# EasyEDA Pro project RCkid.epro, schematic RCKid

## Sheets
1 Power: Board Name: RCKid; Create Date: 2023-09-18; Page Name: Power; Project Name: RCKid3; Schematic Name: RCKid; Update Date: 2025-01-19; Company: EasyEDA.com; Drawed: EasyEDAPro; Page Size: A4; Part Number: JLCPCB-002; Reviewed: EasyEDAPro; Version: V0.1
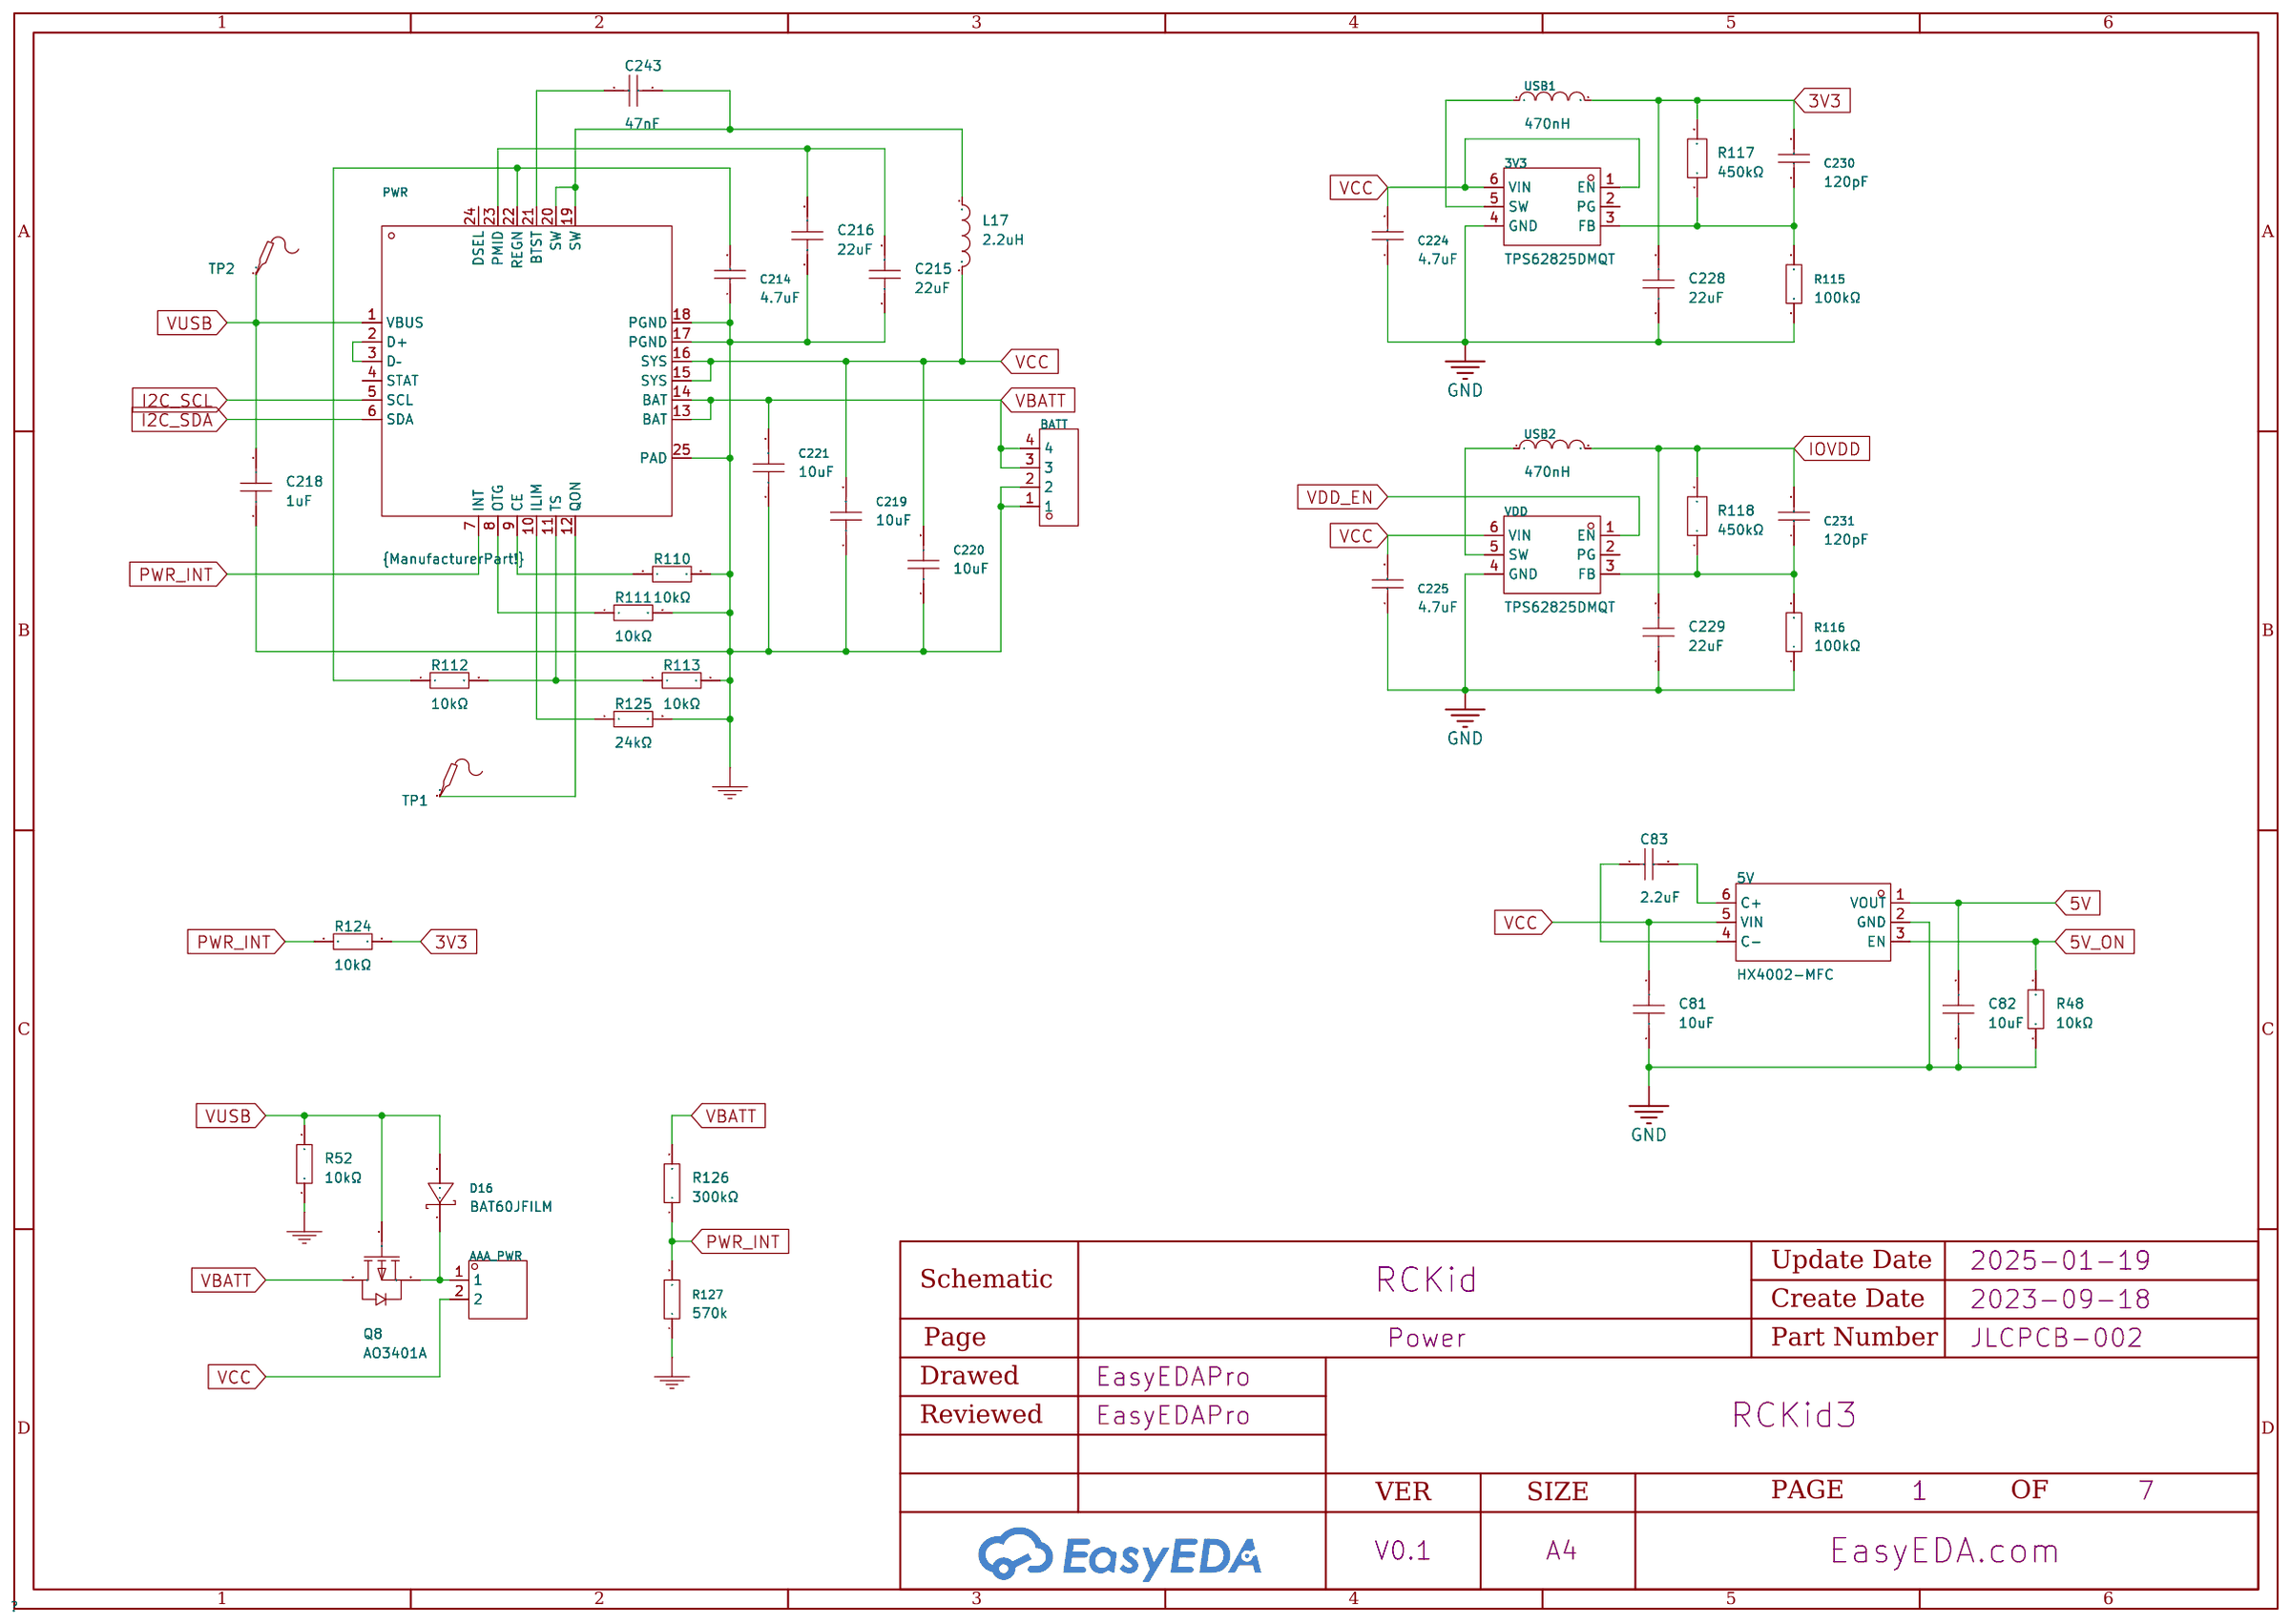
[diagram p7: Power]
2 Logic: Page Name: Logic; Update Date: 2025-01-14
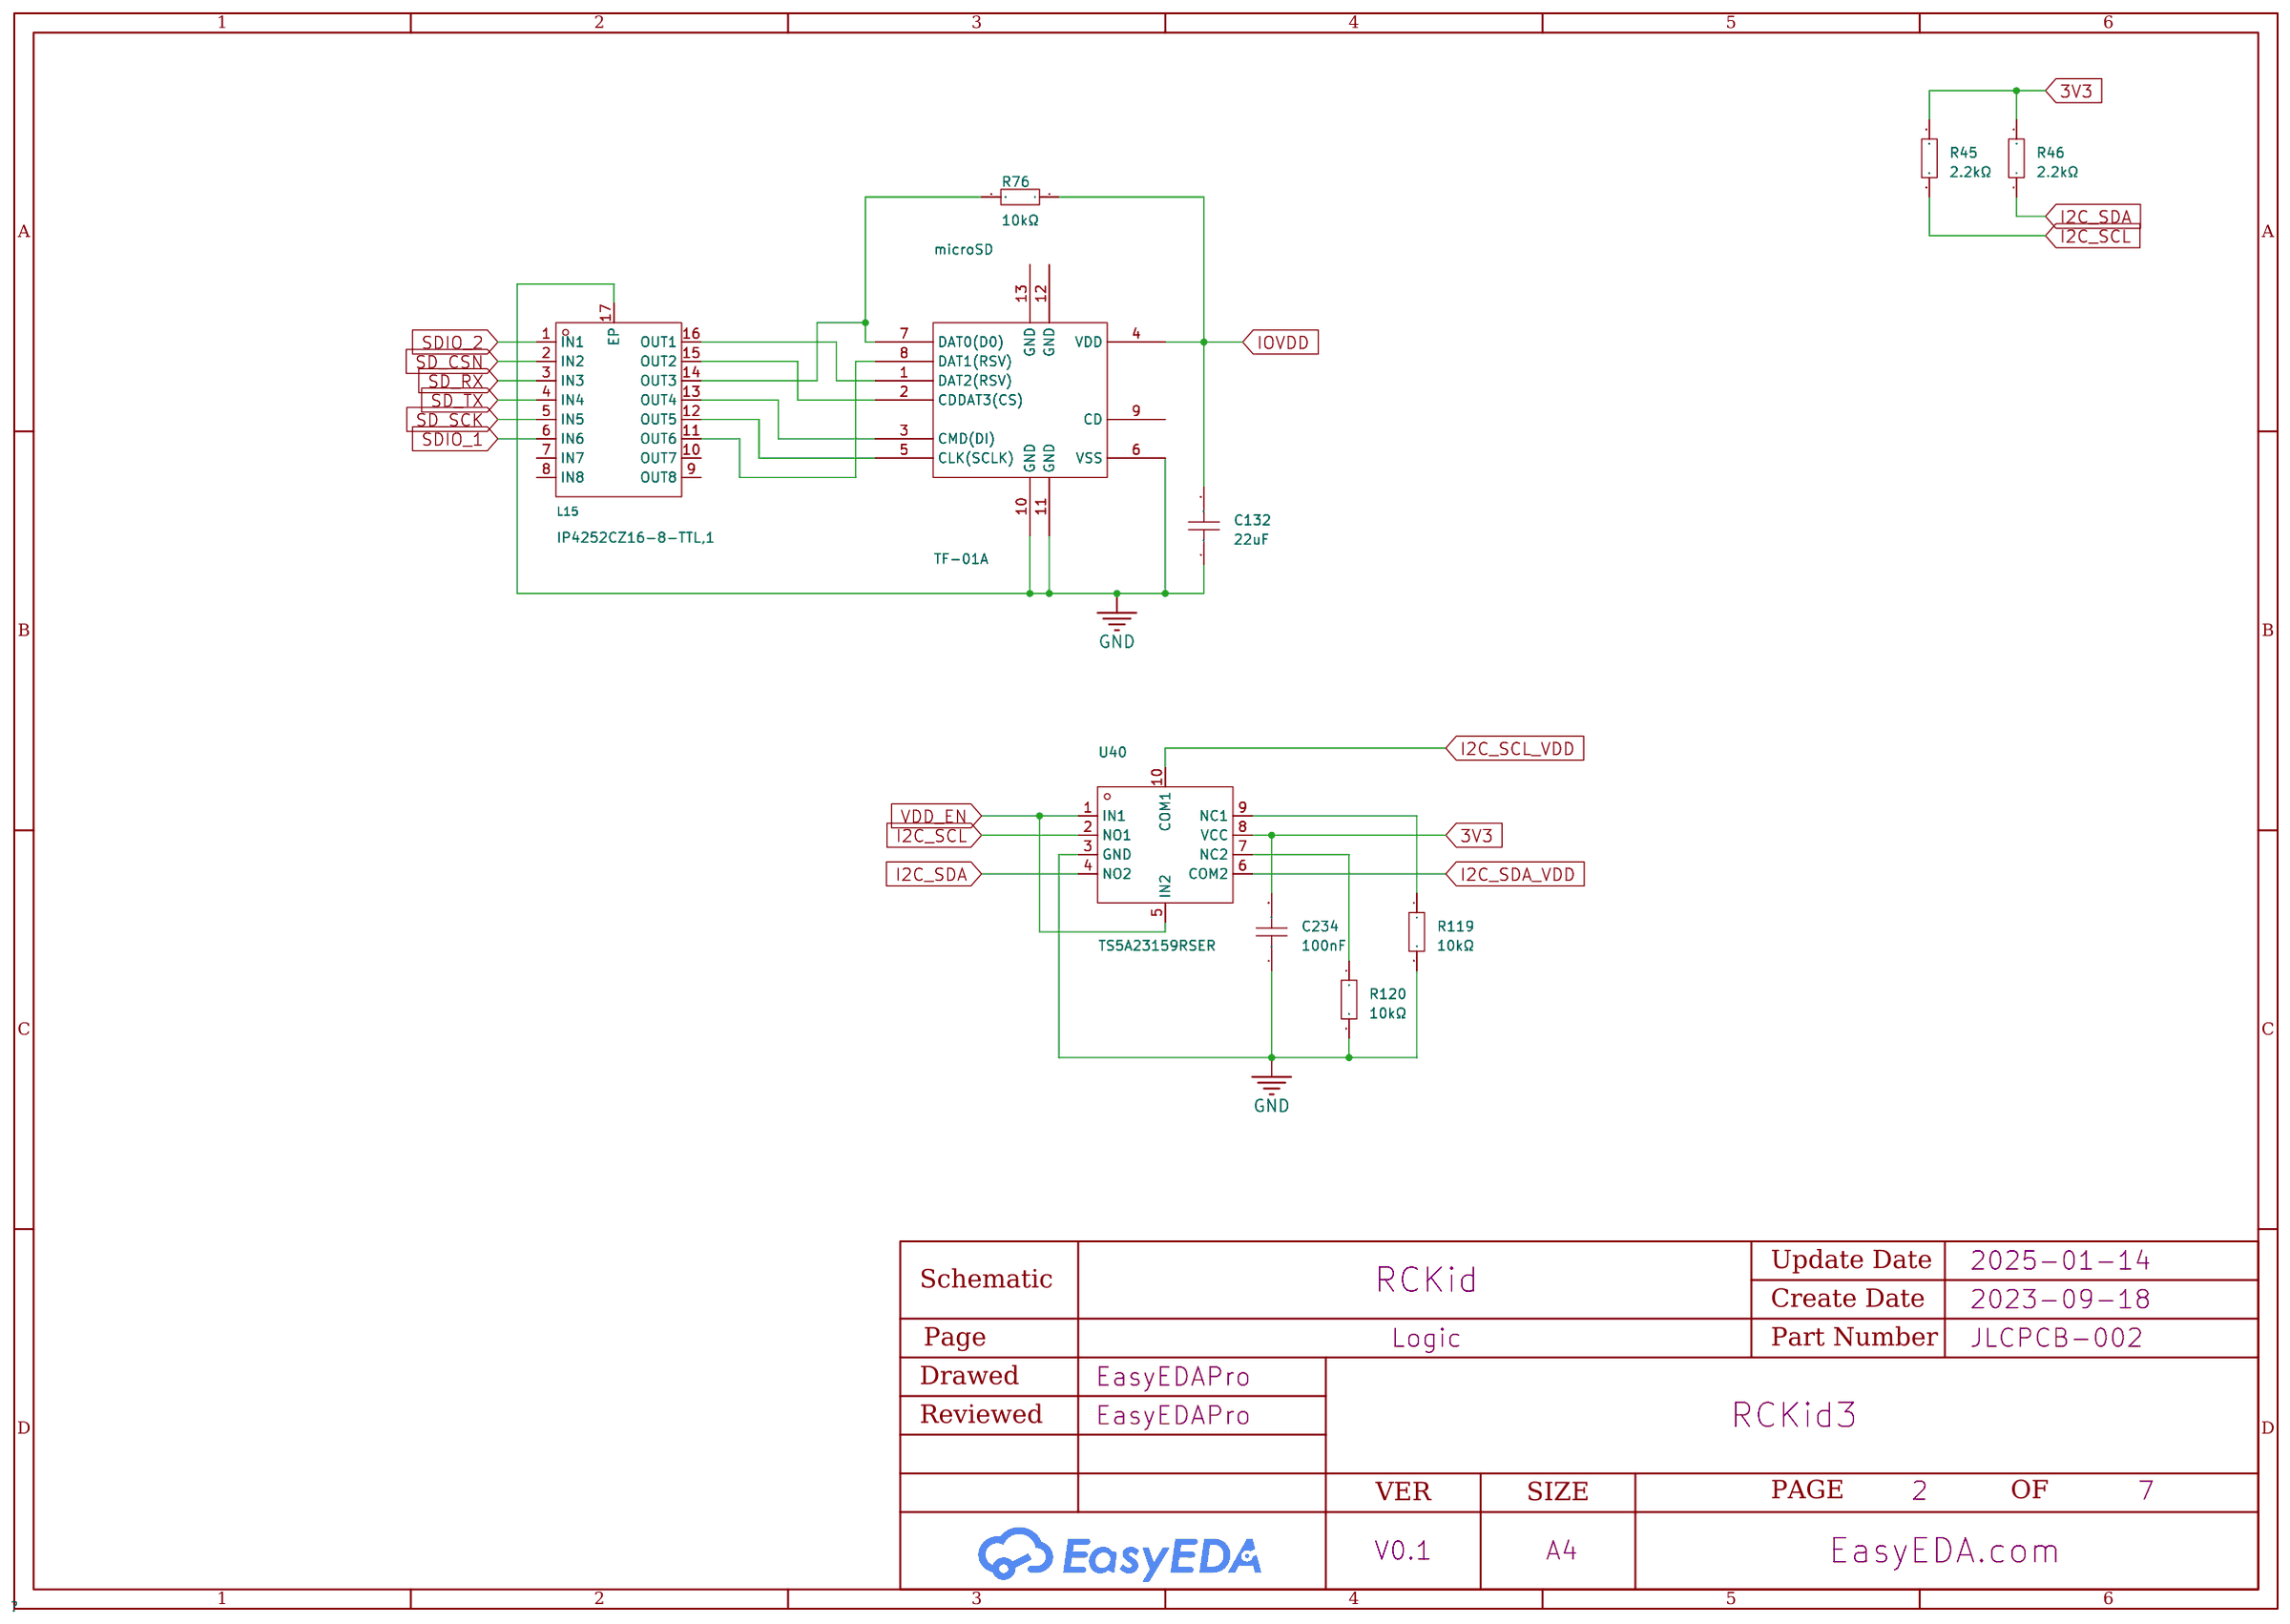
[diagram p8: Logic]
3 Audio: Page Name: Audio; Update Date: 2025-02-18
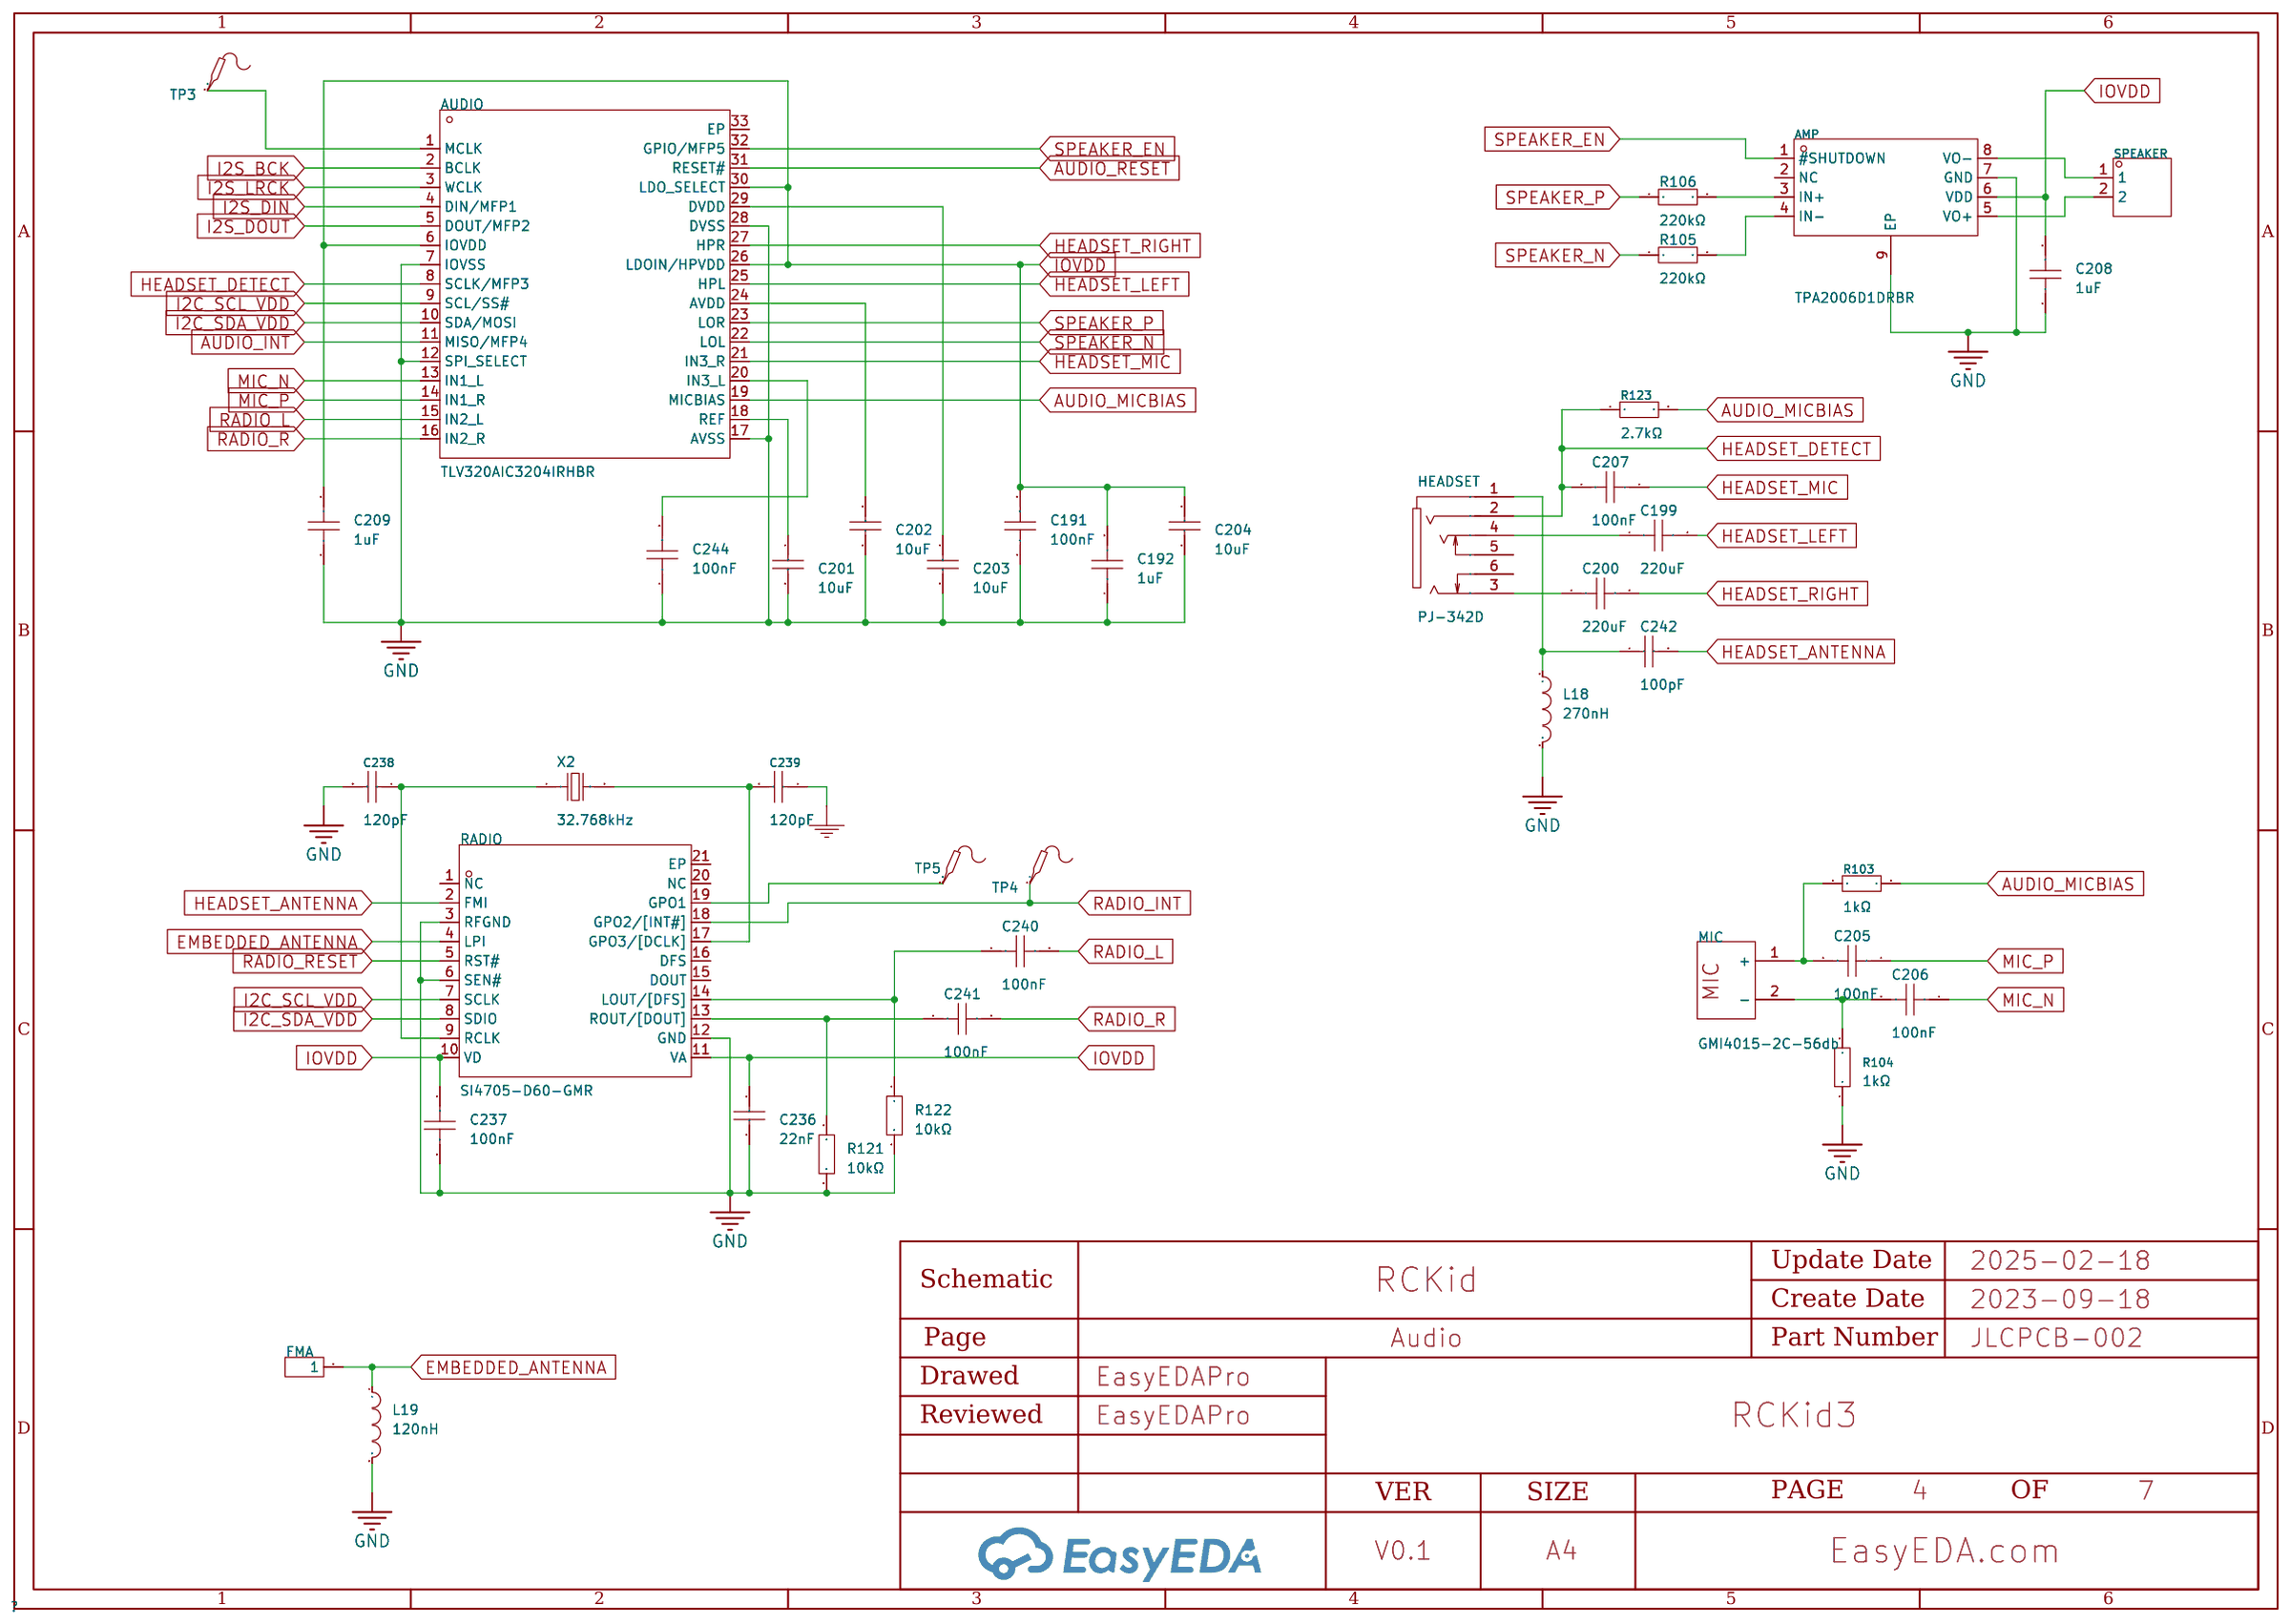
[diagram p9: Audio]
4 IO: Page Name: IO; Update Date: 2025-01-20
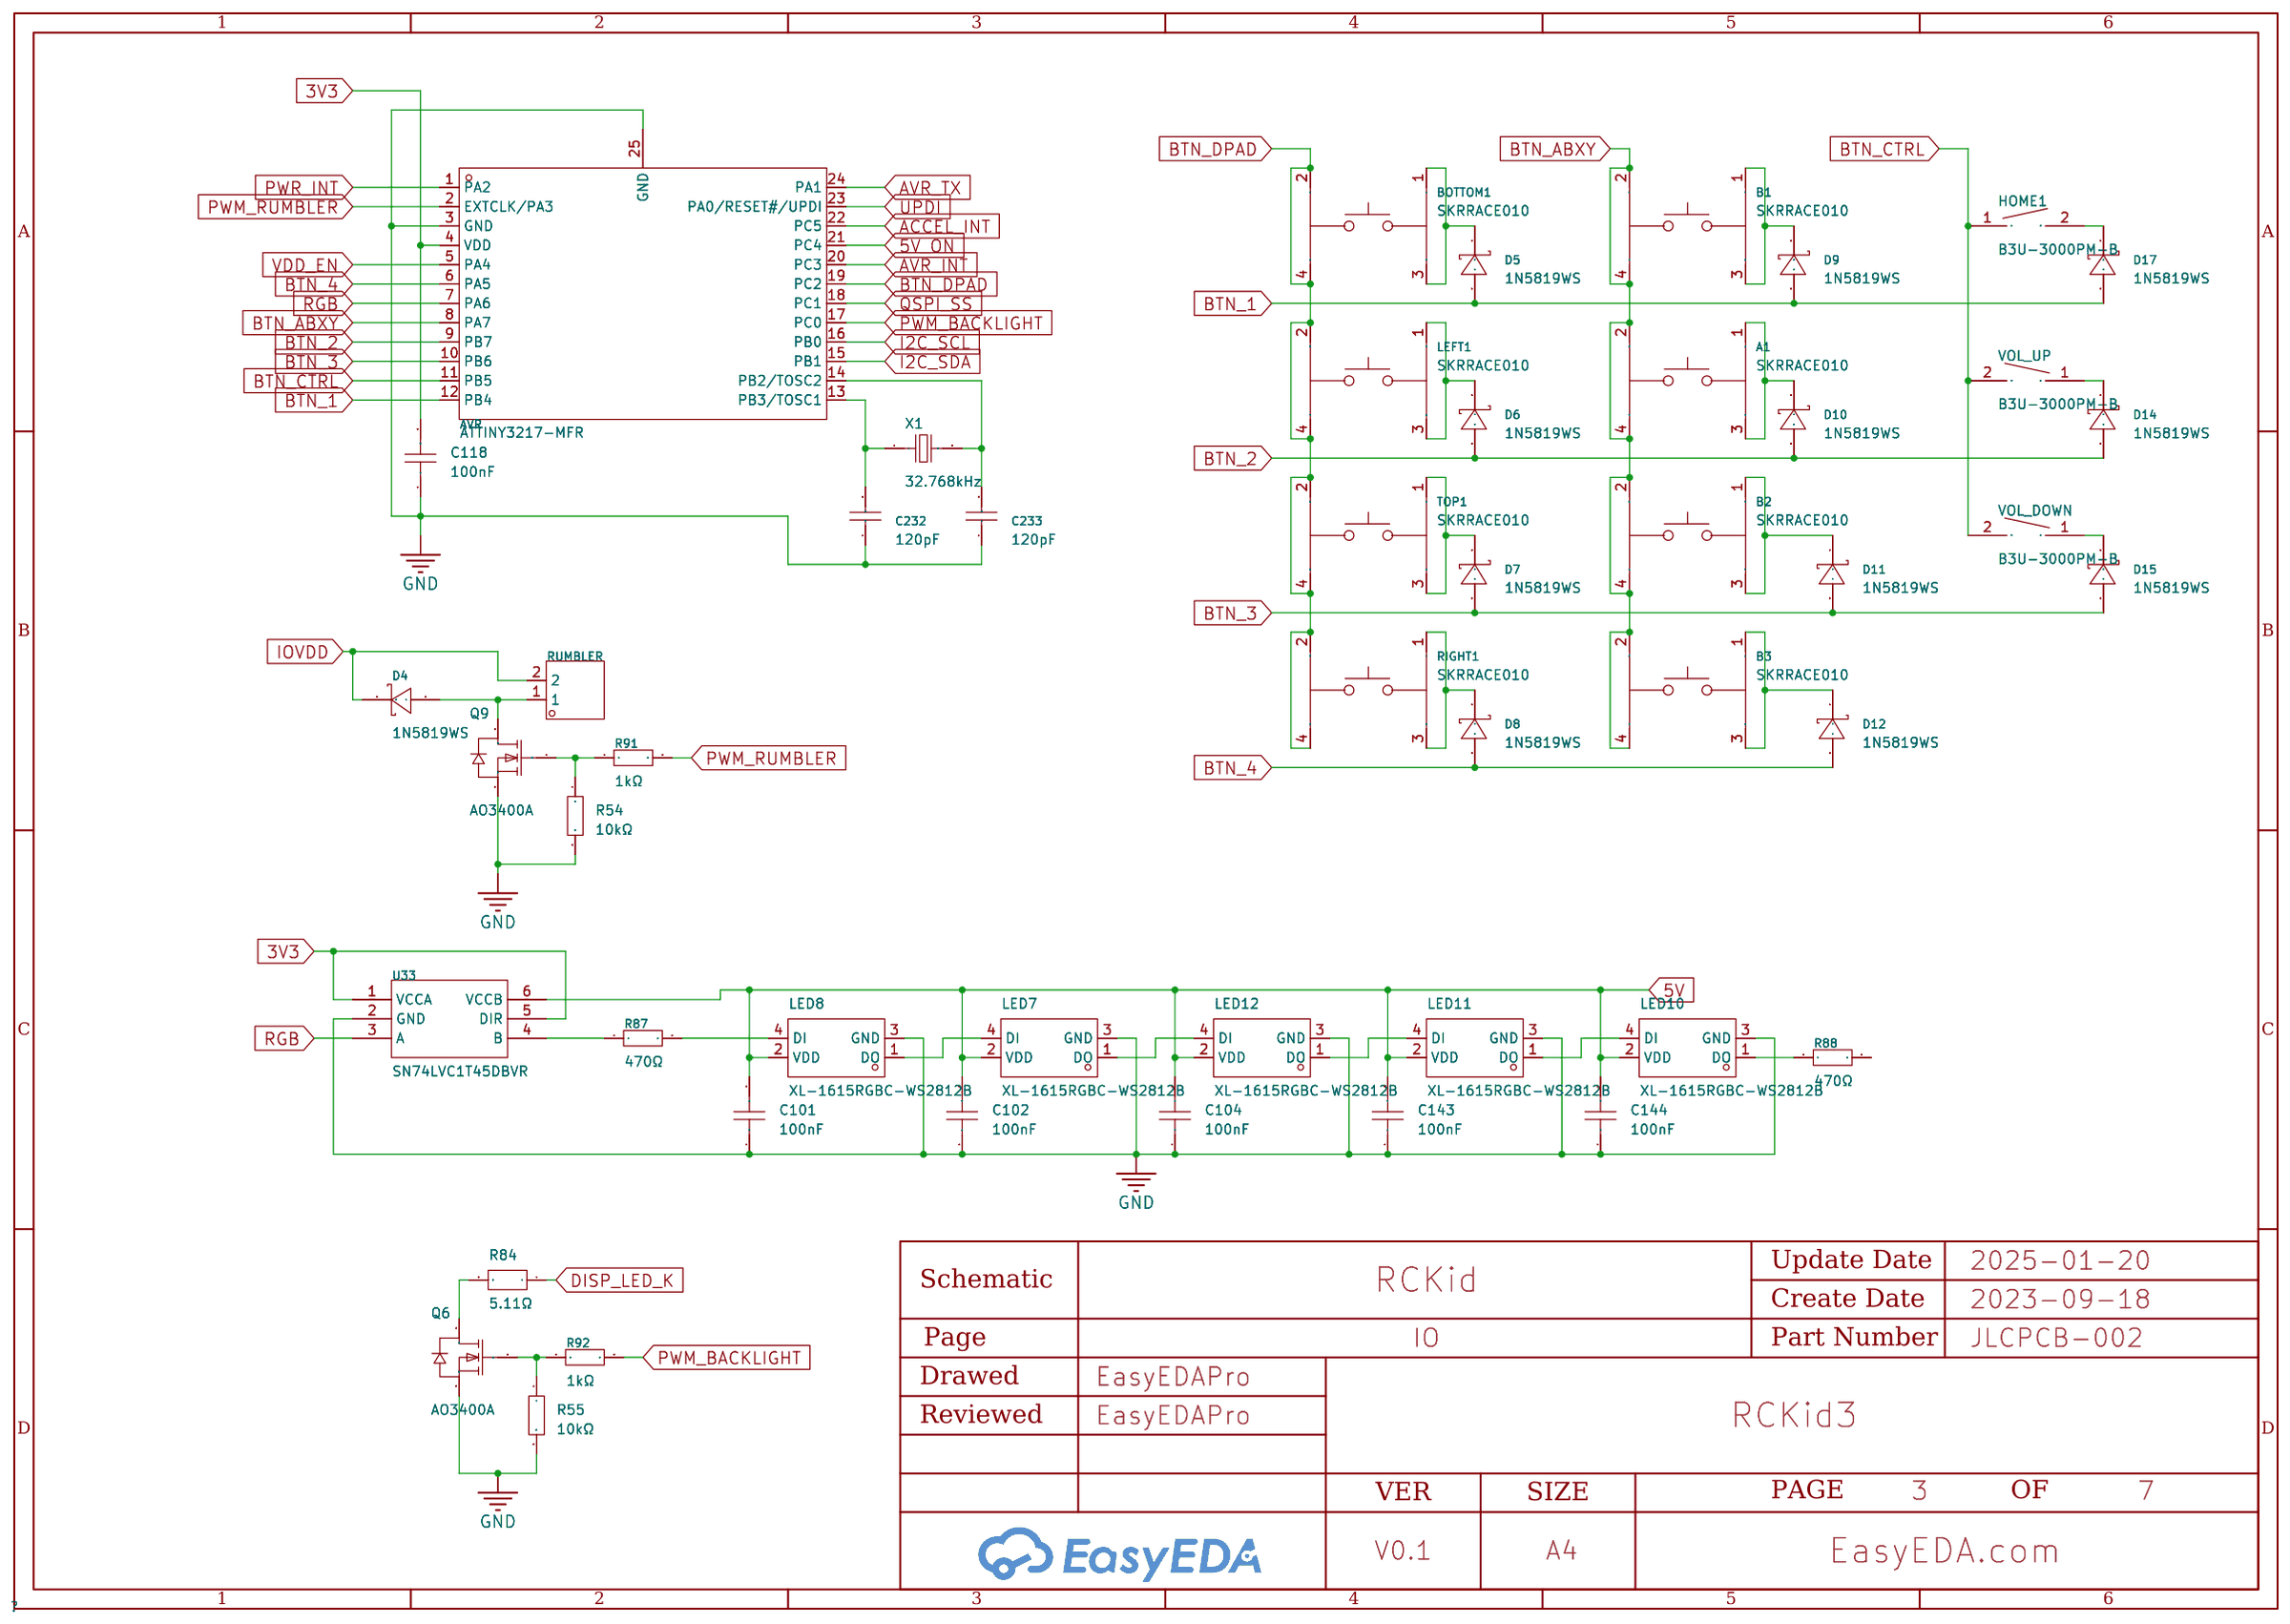
[diagram p10: IO]
5 Sensors: Page Name: Sensors; Update Date: 2025-01-01
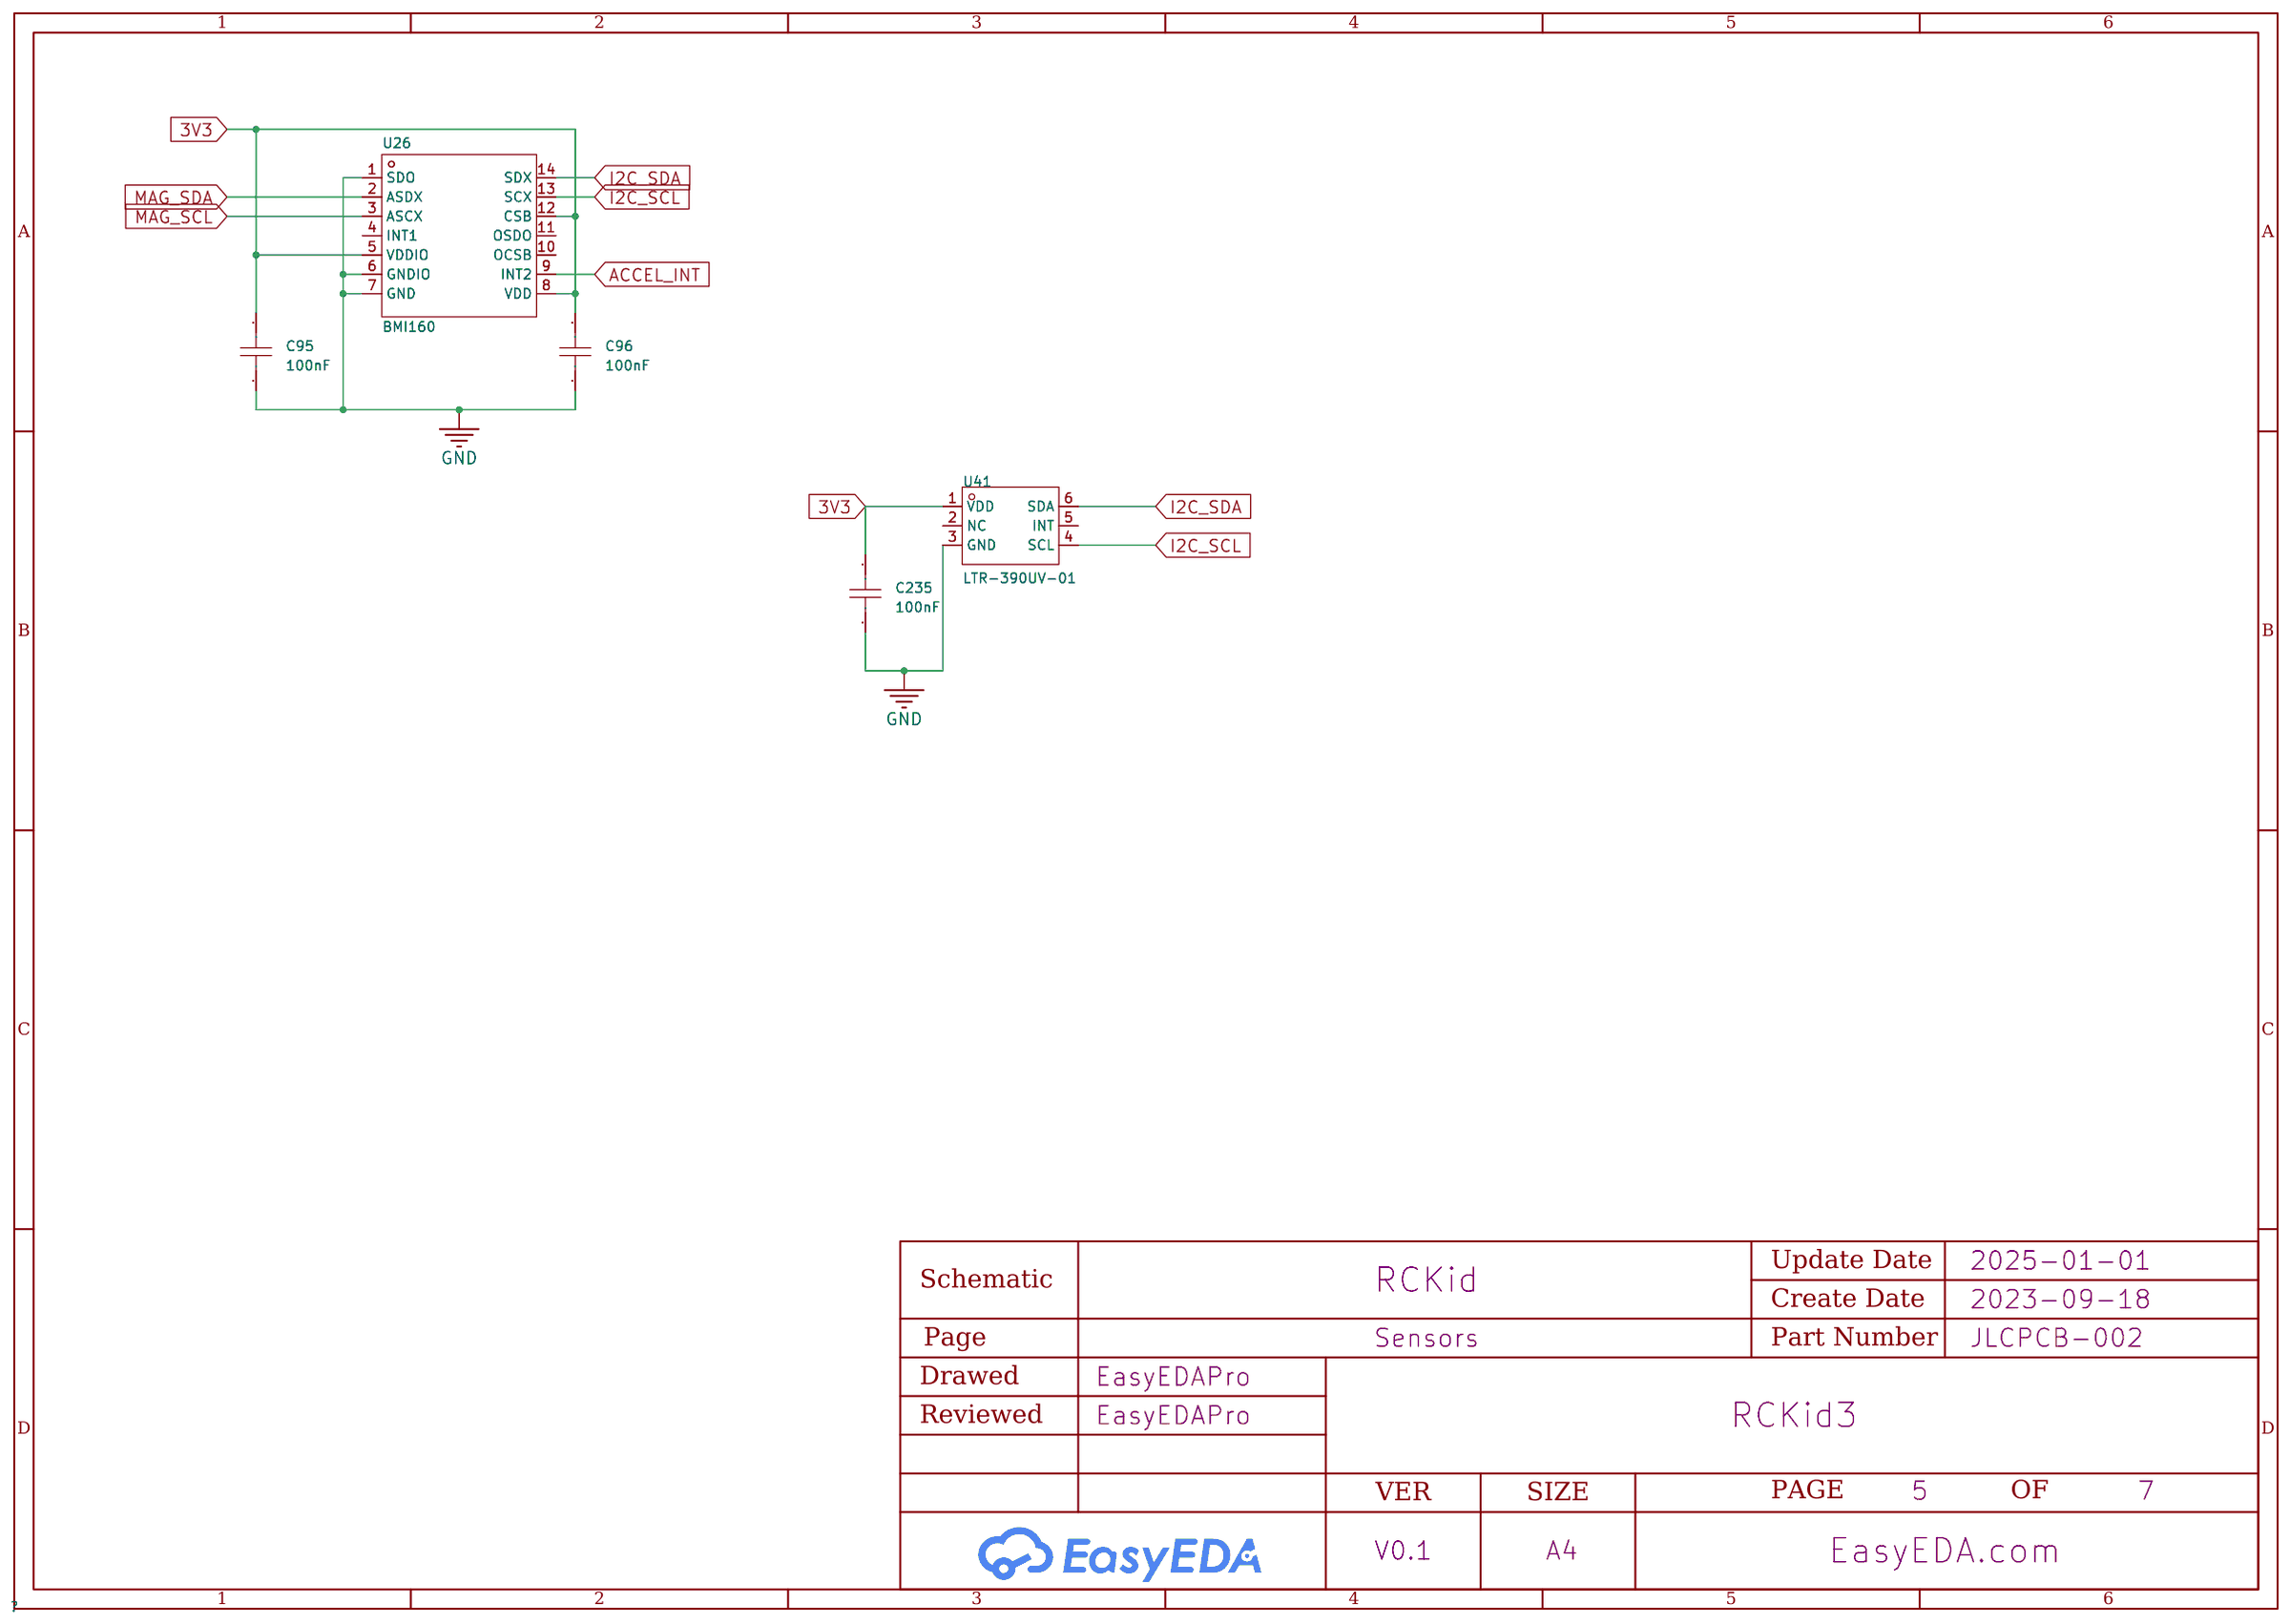
[diagram p11: Sensors]
6 Connectors: Page Name: Connectors; Update Date: 2025-01-20
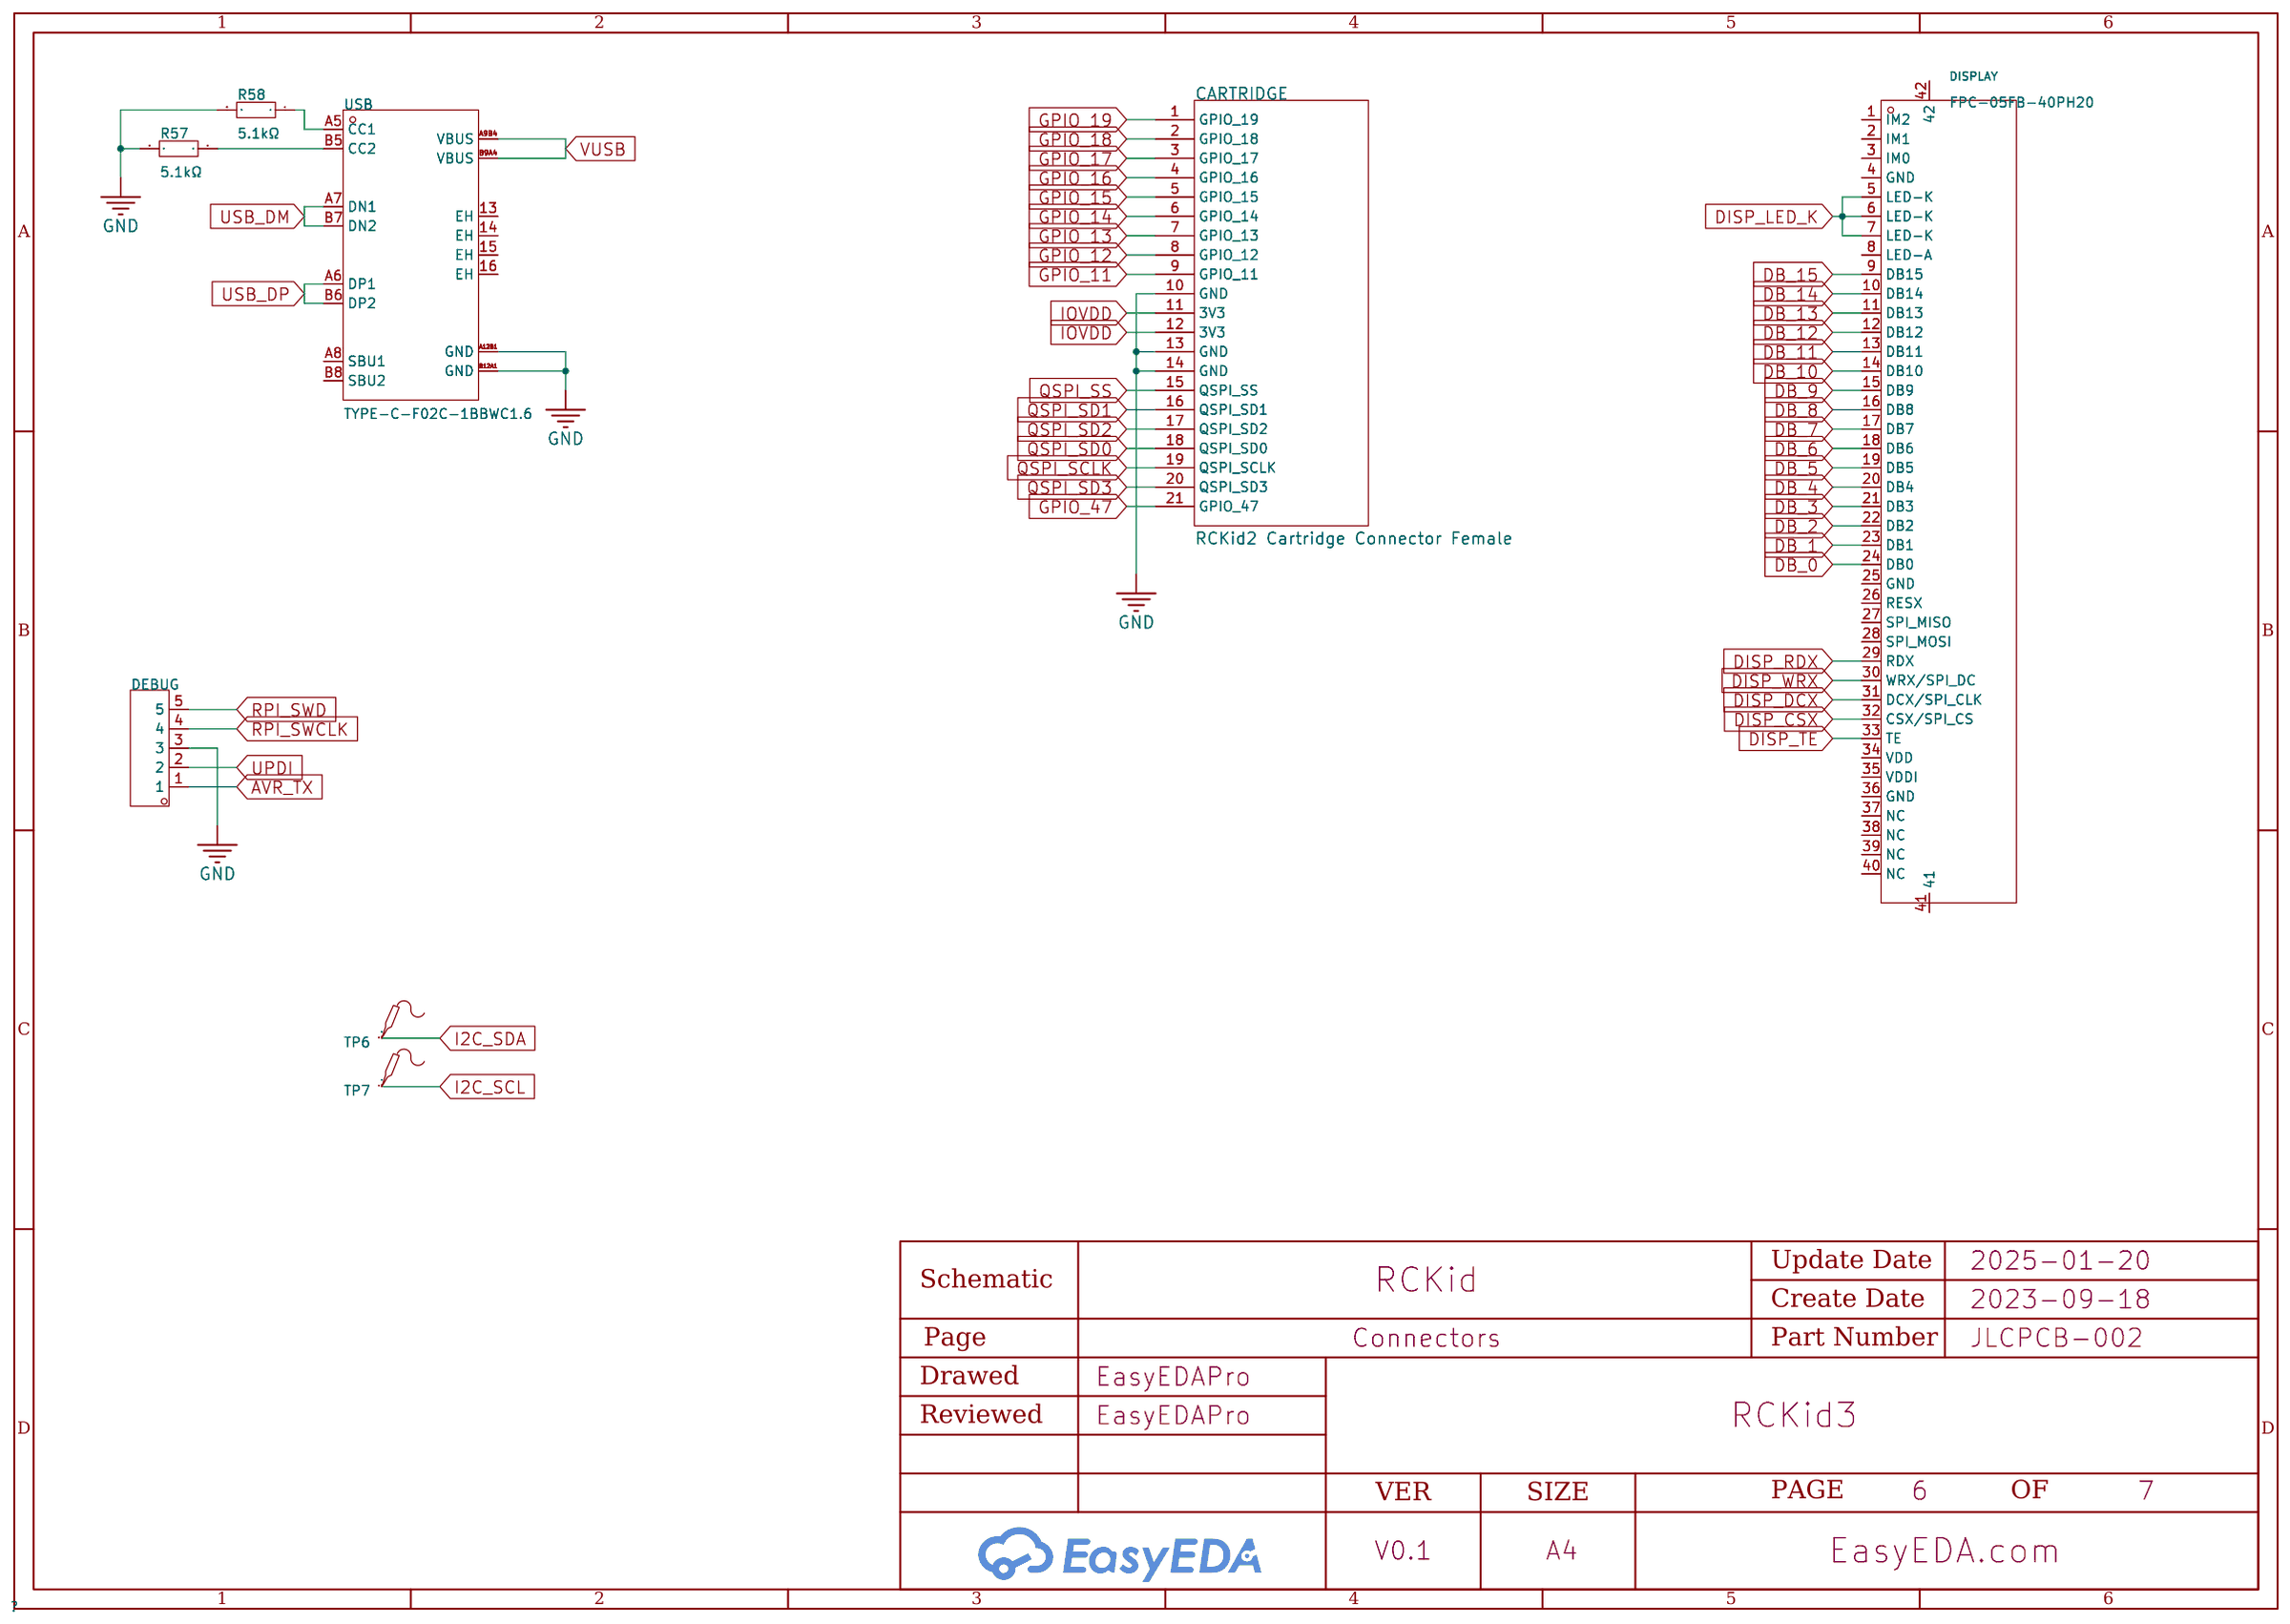
[diagram p12: Connectors]
7 RP2350: Create Date: 2024-12-13; Page Name: RP2350; Update Date: 2025-01-17; Version: V1.0
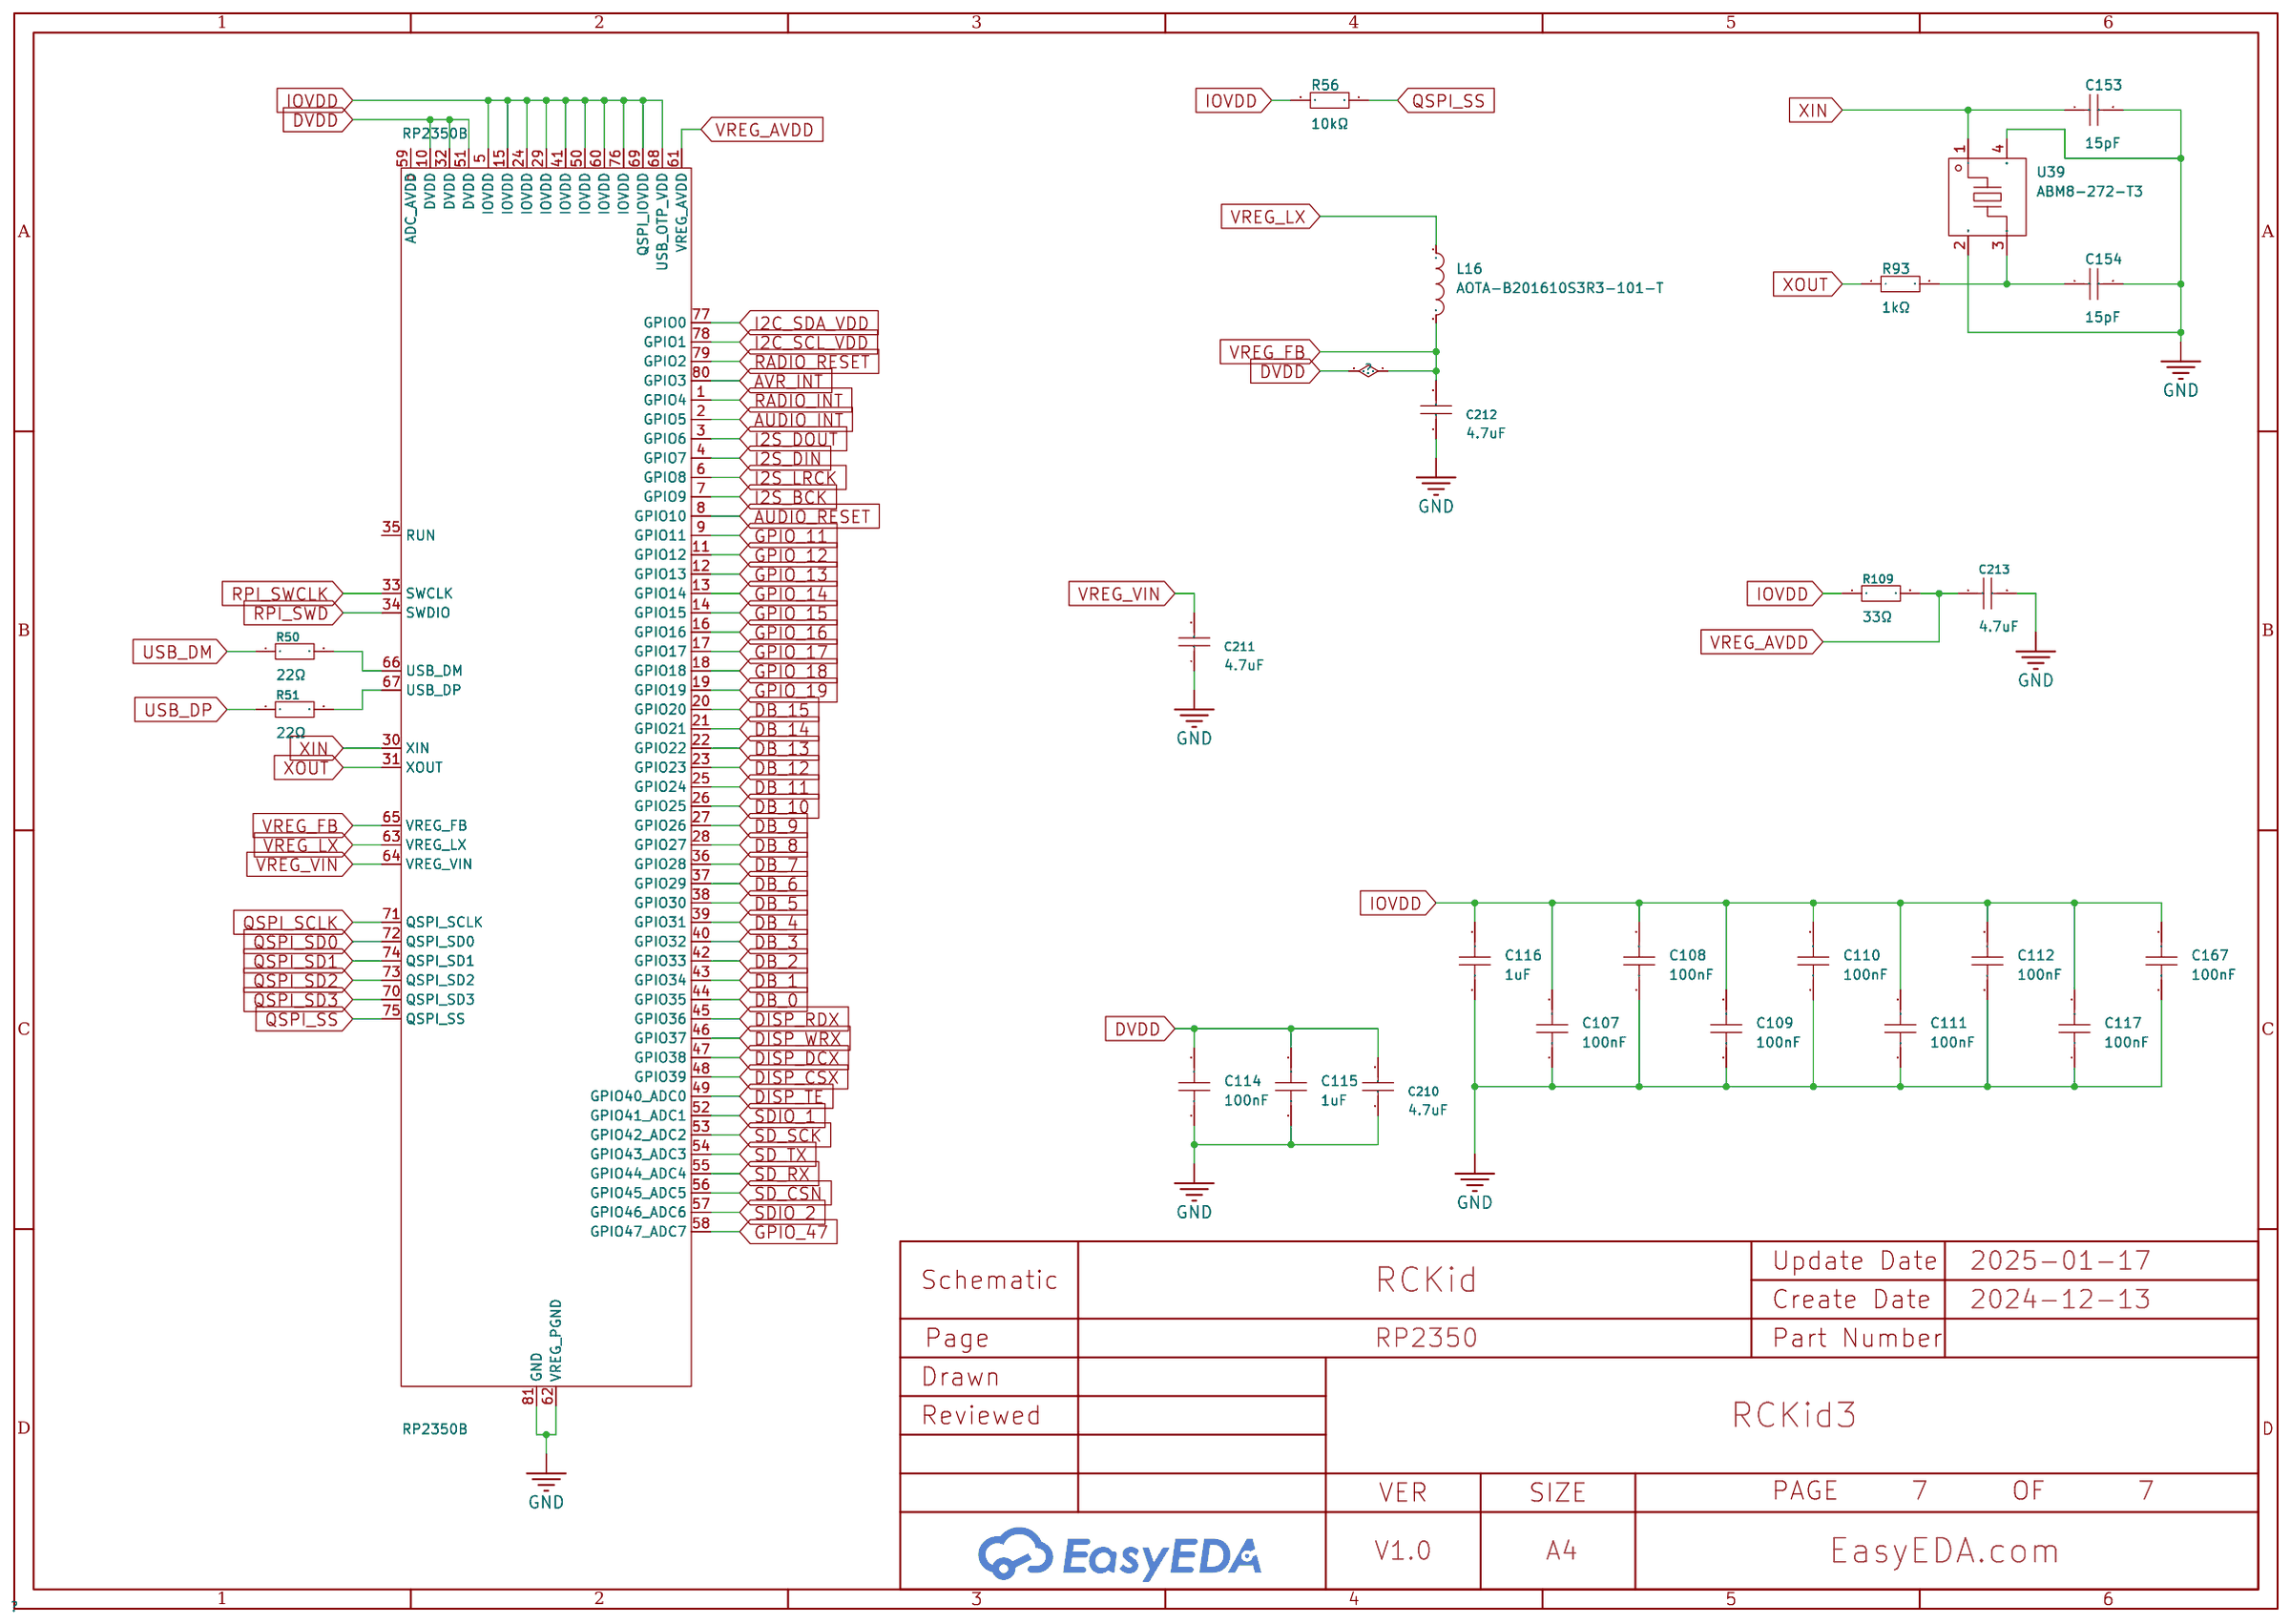
[diagram p13: RP2350]

## Parts
sheet Audio
AMP  TPA2006D1DRBR  [VSON-8_L3.0-W3.0-P0.65-TL-EP]
AUDIO  TLV320AIC3204IRHBR  [QFN-32_L5.0-W5.0-P0.50-TL-EP3.4]
C191  100nF  [C0402]
C192  1uF  [C0402]
C199  220uF  [C1206]
C200  220uF  [C1206]
C201  10uF  [C0402]
C202  10uF  [C0402]
C203  10uF  [C0402]
C204  10uF  [C0402]
C205  100nF  [C0402]
C206  100nF  [C0402]
C207  100nF  [C0402]
C208  1uF  [C0402]
C209  1uF  [C0402]
C236  22nF  [C0402]
C237  100nF  [C0402]
C238  120pF  [C0402]
C239  120pF  [C0402]
C240  100nF  [C0402]
C241  100nF  [C0402]
C242  100pF  [C0402]
C244  100nF  [C0402]
FMA  -  [HDR-TH_1P-V-M_XKB_X4611WV-01I-C28D40]
HEADSET  PJ-342D  [AUDIO-SMD_PJ-342D]
L18  270nH  [L0603]
L19  120nH  [L0805]
MIC  GMI4015-2C-56db  [MIC-SMD_BD4.0_GMI4015-2C-32DB]
R103  1kΩ  [R0402]
R104  1kΩ  [R0402]
R105  220kΩ  [R0402]
R106  220kΩ  [R0402]
R121  10kΩ  [R0402]
R122  10kΩ  [R0402]
R123  2.7kΩ  [R0402]
RADIO  SI4705-D60-GMR  [QFN-20_L3.0-W3.0-P0.50-TL-EP1.7_SILICON-LABS_SI4X55]
SPEAKER  -  [SMT wire pad (2)]
TP3  -  [TESTPOINT-SMD_BD1.5_P70-5000045R]
TP4  -  [TESTPOINT-SMD_BD1.5_P70-5000045R]
TP5  -  [TESTPOINT-SMD_BD1.5_P70-5000045R]
X2  32.768kHz  [FC-135R_L3.2-W1.5]
sheet Connectors
CARTRIDGE  RCKid2 Cartridge Connector Female  [RCKID2 CARTRIDGE FEMALE]
DEBUG  -  [HDR-TH_5P-P2.54-V-M]
DISPLAY  FPC-05FB-40PH20  [FPC-SMD_40P-P0.50_XUNPU_FPC-05FB-40PH20]
R57  5.1kΩ  [R0402]
R58  5.1kΩ  [R0402]
TP6  -  [TESTPOINT-SMD_BD1.5_P70-5000045R]
TP7  -  [TESTPOINT-SMD_BD1.5_P70-5000045R]
USB  TYPE-C-F02C-1BBWC1.6  [USB-C-SMD_TYPE-C-F02C-1BBWC1.6]
sheet IO
A1  SKRRACE010  [KEY-SMD_4P-L7.5-W7.0-P5.00-TL]
AVR  ATTINY3217-MFR  [WQFN-24_L4.0-W4.0-P0.50-TL-EP2.6]
B1  SKRRACE010  [KEY-SMD_4P-L7.5-W7.0-P5.00-TL]
B2  SKRRACE010  [KEY-SMD_4P-L7.5-W7.0-P5.00-TL]
B3  SKRRACE010  [KEY-SMD_4P-L7.5-W7.0-P5.00-TL]
BOTTOM1  SKRRACE010  [KEY-SMD_4P-L7.5-W7.0-P5.00-TL]
C101  100nF  [C0402]
C102  100nF  [C0402]
C104  100nF  [C0402]
C118  100nF  [C0402]
C143  100nF  [C0402]
C144  100nF  [C0402]
C232  120pF  [C0402]
C233  120pF  [C0402]
D4  1N5819WS  [SOD-323_L1.8-W1.3-LS2.5-RD]
D5  1N5819WS  [SOD-323_L1.8-W1.3-LS2.5-RD]
D6  1N5819WS  [SOD-323_L1.8-W1.3-LS2.5-RD]
D7  1N5819WS  [SOD-323_L1.8-W1.3-LS2.5-RD]
D8  1N5819WS  [SOD-323_L1.8-W1.3-LS2.5-RD]
D9  1N5819WS  [SOD-323_L1.8-W1.3-LS2.5-RD]
D10  1N5819WS  [SOD-323_L1.8-W1.3-LS2.5-RD]
D11  1N5819WS  [SOD-323_L1.8-W1.3-LS2.5-RD]
D12  1N5819WS  [SOD-323_L1.8-W1.3-LS2.5-RD]
D14  1N5819WS  [SOD-323_L1.8-W1.3-LS2.5-RD]
D15  1N5819WS  [SOD-323_L1.8-W1.3-LS2.5-RD]
D17  1N5819WS  [SOD-323_L1.8-W1.3-LS2.5-RD]
HOME1  B3U-3000PM-B  [KEY-SMD_B3U-3000PM-B]
LED7  XL-1615RGBC-WS2812B  [LED-SMD_4P-L1.6-W1.5_XL-1615RGBC-WS2812B]
LED8  XL-1615RGBC-WS2812B  [LED-SMD_4P-L1.6-W1.5_XL-1615RGBC-WS2812B]
LED10  XL-1615RGBC-WS2812B  [LED-SMD_4P-L1.6-W1.5_XL-1615RGBC-WS2812B]
LED11  XL-1615RGBC-WS2812B  [LED-SMD_4P-L1.6-W1.5_XL-1615RGBC-WS2812B]
LED12  XL-1615RGBC-WS2812B  [LED-SMD_4P-L1.6-W1.5_XL-1615RGBC-WS2812B]
LEFT1  SKRRACE010  [KEY-SMD_4P-L7.5-W7.0-P5.00-TL]
Q6  AO3400A  [SOT-23-3_L2.9-W1.6-P1.90-LS2.8-BR]
Q9  AO3400A  [SOT-23-3_L2.9-W1.6-P1.90-LS2.8-BR]
R54  10kΩ  [R0402]
R55  10kΩ  [R0402]
R84  5.11Ω  [R0402]
R87  470Ω  [R0402]
R88  470Ω  [R0402]
R91  1kΩ  [R0402]
R92  1kΩ  [R0402]
RIGHT1  SKRRACE010  [KEY-SMD_4P-L7.5-W7.0-P5.00-TL]
RUMBLER  -  [SMT wire pad (2)]
TOP1  SKRRACE010  [KEY-SMD_4P-L7.5-W7.0-P5.00-TL]
U33  SN74LVC1T45DBVR  [SOT-23-6_L2.9-W1.6-P0.95-LS2.8-BR]
VOL_DOWN  B3U-3000PM-B  [KEY-SMD_B3U-3000PM-B]
VOL_UP  B3U-3000PM-B  [KEY-SMD_B3U-3000PM-B]
X1  32.768kHz  [FC-135R_L3.2-W1.5]
sheet Logic
C132  22uF  [C0603]
C234  100nF  [C0402]
L15  IP4252CZ16-8-TTL,1  [UDFN-16_L3.3-W1.4-P0.40-BL-EP]
microSD  TF-01A  [TF-SMD_TF-01A]
R45  2.2kΩ  [R0402]
R46  2.2kΩ  [R0402]
R76  10kΩ  [R0402]
R119  10kΩ  [R0402]
R120  10kΩ  [R0402]
U40  TS5A23159RSER  [UQFN-10_L2.0-W1.5-P0.50-BL-EP]
sheet Power
3V3  TPS62825DMQT  [VSON-6_L1.5-W1.5-P0.50-TL]
5V  HX4002-MFC  [SOT-23-6_L2.9-W1.6-P0.95-LS2.8-BR]
AAA_PWR  -  [HDR-TH_2P-P2.54-V-M-1]
BATT  -  [HDR-TH_4P-P2.54-V-M]
C81  10uF  [C0603]
C82  10uF  [C0603]
C83  2.2uF  [C0603]
C214  4.7uF  [C0402]
C215  22uF  [C0603]
C216  22uF  [C0603]
C218  1uF  [C0402]
C219  10uF  [C0603]
C220  10uF  [C0603]
C221  10uF  [C0603]
C224  4.7uF  [C0402]
C225  4.7uF  [C0402]
C228  22uF  [C0603]
C229  22uF  [C0603]
C230  120pF  [C0402]
C231  120pF  [C0402]
C243  47nF  [C0603]
D16  BAT60JFILM  [SOD-323_L1.8-W1.3-LS2.5-RD]
L17  2.2uH  [IND-SMD_L3.0-W3.0_IHLP-1212BZ]
PWR  -  [QFN-24_L4.0-W4.0-P0.50-TL-EP2.7]
Q8  AO3401A  [SOT-23_L2.9-W1.3-P1.90-LS2.4-BR]
R48  10kΩ  [R0402]
R52  10kΩ  [R0402]
R110  10kΩ  [R0402]
R111  10kΩ  [R0402]
R112  10kΩ  [R0402]
R113  10kΩ  [R0402]
R115  100kΩ  [R0402]
R116  100kΩ  [R0402]
R117  450kΩ  [R0402]
R118  450kΩ  [R0402]
R124  10kΩ  [R0402]
R125  24kΩ  [R0402]
R126  300kΩ  [R0805]
R127  570k  [R0805]
TP1  -  [TESTPOINT-SMD_BD1.5_P70-5000045R]
TP2  -  [TESTPOINT-SMD_BD1.5_P70-5000045R]
USB1  470nH  [IND-SMD_L2.0-W1.6]
USB2  470nH  [IND-SMD_L2.0-W1.6]
VDD  TPS62825DMQT  [VSON-6_L1.5-W1.5-P0.50-TL]
sheet RP2350
C107  100nF  [C0402]
C108  100nF  [C0402]
C109  100nF  [C0402]
C110  100nF  [C0402]
C111  100nF  [C0402]
C112  100nF  [C0402]
C114  100nF  [C0402]
C115  1uF  [C0402]
C116  1uF  [C0402]
C117  100nF  [C0402]
C153  15pF  [C0402]
C154  15pF  [C0402]
C167  100nF  [C0402]
C210  4.7uF  [C0402]
C211  4.7uF  [C0402]
C212  4.7uF  [C0402]
C213  4.7uF  [C0402]
L16  AOTA-B201610S3R3-101-T  [IND-SMD_L2.0-W1.6_AOTA-B201610S3R3-101-T]
R50  22Ω  [R0402]
R51  22Ω  [R0402]
R56  10kΩ  [R0402]
R93  1kΩ  [R0402]
R109  33Ω  [R0402]
RP2350B  RP2350B  [QFN-80_L10.0-W10.0-P0.40-TL-EP3.4]
U39  ABM8-272-T3  [CRYSTAL-SMD_4P-L3.2-W2.5-BL]
sheet Sensors
C95  100nF  [C0402]
C96  100nF  [C0402]
C235  100nF  [C0402]
U26  BMI160  [LGA-14_L3.0-W2.5-P0.50-BL]
U41  LTR-390UV-01  [SENSOR-SMD_LTR-390UV-01]

## Library data of the parts
AMP = TPA2006D1DRBR: Type of Power Amplifier: Output Power:; LCSC Part Name: 2.5W单声道D类音频功率放大器; Supplier Part: C524793; Manufacturer: TI(德州仪器); Supplier Footprint: VSON-8-EP(3x3); JLCPCB Part Class: Extended Part; Datasheet: https://www.ti.com/cn/lit/gpn/tpa2006d1; Supplier: LCSC
AUDIO = TLV320AIC3204IRHBR: Type:Codec Interface:I2C；SPI Sampling Frequency:- Sampling Frequency:- Supply Voltage:- Supply Voltage:- Operating Temperature:-40℃~+85℃ Operating Temperature:-40℃~+85℃; LCSC Part Name: 超低功耗立体声音频编解码器; Supplier Part: C24109; Manufacturer: TI(德州仪器); Supplier Footprint: QFN-32-EP(5x5); JLCPCB Part Class: Extended Part; Datasheet: https://www.ti.com/cn/lit/gpn/tlv320aic3204; Supplier: LCSC; Type: Codec; Interface: I2C；SPI; Operating Temperature: -40℃~+85℃
C95 C96 C101 C102 C104 C107-C112 C114 C117 C118 C143 C144 C167 C191 C205-C207 C234 C235 C237 C240 C241 C244 = CL05B104KB54PNC: Capacitance: Tolerance:±10% Tolerance:±10% Voltage Rated: Temperature Coefficient:; LCSC Part Name: 100nF ±10% 50V; Supplier Part: C307331; Manufacturer: SAMSUNG(三星); Supplier Footprint: 0402; JLCPCB Part Class: Basic Part; Datasheet: https://atta.szlcsc.com/upload/public/pdf/source/20181009/C307331_222F7C870FD3EA5F46F538B483443886.pdf; Supplier: LCSC; Tolerance: ±10%
C115 C116 C192 C208 C209 C218 = CL05A105KA5NQNC: Capacitance: Tolerance:±10% Tolerance:±10% Voltage Rated: Temperature Coefficient:; LCSC Part Name: 1uF±10%25V; Supplier Part: C52923; Manufacturer: SAMSUNG(三星); Supplier Footprint: 0402; JLCPCB Part Class: BasicPart; Datasheet: https://atta.szlcsc.com/upload/public/pdf/source/20160103/1457707735223.pdf; Supplier: LCSC; Tolerance: ±10%
C199 C200 = GRM31CR60J227ME11L: Capacitance: Tolerance:±20% Tolerance:±20% Voltage Rated: Temperature Coefficient:; LCSC Part Name: 220uF ±20% 6.3V; Supplier Part: C412252; Manufacturer: muRata(村田); Supplier Footprint: 1206; JLCPCB Part Class: Extended Part; Datasheet: https://atta.szlcsc.com/upload/public/pdf/source/20190904/C426118_85E81C7C1F21FC87C5FB6D536E0847B4.pdf; Supplier: LCSC; Tolerance: ±20%
C201-C204 = CL05A106MQ5NUNC: Capacitance: Tolerance:±20% Tolerance:±20% Voltage Rated: Temperature Coefficient:; LCSC Part Name: 10uF±20%6.3V; Supplier Part: C15525; Manufacturer: SAMSUNG(三星); Supplier Footprint: 0402; JLCPCB Part Class: BasicPart; Datasheet: https://atta.szlcsc.com/upload/public/pdf/source/20220823/2B02EE04F8F211D38A52DCB16EB6BEBA.pdf; Supplier: LCSC; Tolerance: ±20%
C236 = 0402B223K500NT: Capacitance:22nF Tolerance:±10% Tolerance:±10% Voltage Rated: Temperature Coefficient:; LCSC Part Name: 22nF ±10% 50V; Supplier Part: C1532; Manufacturer: FH(风华); Supplier Footprint: 0402; JLCPCB Part Class: Basic Part; Datasheet: https://atta.szlcsc.com/upload/public/pdf/source/20200305/C486355_26A10D38EF8C2A5C37091D0039909270.pdf; Supplier: LCSC; Tolerance: ±10%
C230-C233 C238 C239 = CC0402JRNPO9BN121: Capacitance: Tolerance:±5% Tolerance:±5% Voltage Rated: Temperature Coefficient:; LCSC Part Name: 120pF ±5% 50V; Supplier Part: C106996; Manufacturer: YAGEO(国巨); Supplier Footprint: 0402; JLCPCB Part Class: Extended Part; Datasheet: https://atta.szlcsc.com/upload/public/pdf/source/20170914/C128857_1505359892143968080.pdf; Supplier: LCSC; Tolerance: ±5%
C242 = 0402CG101J500NT: Capacitance: Tolerance:±5% Tolerance:±5% Voltage Rated: Temperature Coefficient:; LCSC Part Name: 100pF ±5% 50V; Supplier Part: C1546; Manufacturer: FH(风华); Supplier Footprint: 0402; JLCPCB Part Class: Basic Part; Datasheet: https://atta.szlcsc.com/upload/public/pdf/source/20200305/C486355_26A10D38EF8C2A5C37091D0039909270.pdf; Supplier: LCSC; Tolerance: ±5%
FMA = HDR-M_2.54_1x1P: Supplier Footprint: Through
HEADSET = PJ-342D: Connector Type:3.5mm耳机座 Current Rating (Max):500mA Voltage Rating (Max):30V Operating Temperature Range:-20℃~+70℃ Operating Temperature Range:-20℃~+70℃ Soldering Temperature(Max):235℃; LCSC Part Name: 3.5mm耳机座; Supplier Part: C2689707; Manufacturer: XKB Connectivity(中国星坤); Supplier Footprint: SMD; JLCPCB Part Class: Extended Part; Datasheet: https://atta.szlcsc.com/upload/public/pdf/source/20211011/5410BBAF7F4CEA04F8E2A1AE1B358EC2.pdf; Supplier: LCSC; Connector Type: 3.5mm耳机座; Current Rating (Max): 500mA; Voltage Rating (Max): 30V; Operating Temperature Range: -20℃~+70℃; Soldering Temperature(Max): 235℃
L18 = MLF1608DR27JT000: Inductance: Tolerance:±5% Tolerance:±5% Rated Current: Saturation Current (Isat):- DC Resistance (DCR): Q @ Freq:15@25MHz Frequency - Self Resonant:260MHz Ratings:; LCSC Part Name: 270nH ±5%; Supplier Part: C87519; Manufacturer: TDK; Supplier Footprint: 0603; JLCPCB Part Class: Extended Part; Datasheet: https://atta.szlcsc.com/upload/public/pdf/source/20191023/C440659_C3A2993F9C3C9B25E061479B1BCAA800.pdf; Supplier: LCSC; Tolerance: ±5%; Q @ Freq: 15@25MHz; Frequency - Self Resonant: 260MHz
L19 = MLF2012DR12JT000: Inductance: Tolerance:±5% Tolerance:±5% Rated Current: Saturation Current (Isat):- DC Resistance (DCR): Q @ Freq:20@25MHz Frequency - Self Resonant:360MHz Ratings:; LCSC Part Name: 120nH ±5%; Supplier Part: C275379; Manufacturer: TDK; Supplier Footprint: 0805; JLCPCB Part Class: Extended Part; Datasheet: https://atta.szlcsc.com/upload/public/pdf/source/20190108/C360707_9A5133A313C174521C900275925A1073.pdf; Supplier: LCSC; Tolerance: ±5%; Q @ Freq: 20@25MHz; Frequency - Self Resonant: 360MHz
MIC = GMI4015-2C-56db: LCSC Part Name: 全指向双电容φ4.0*1.5mm 1.5V-10V 灵敏度-56dB 低阻抗; Supplier Part: C233280; Manufacturer: INGHAi(赢海); JLCPCB Part Class: Extended Part; Datasheet: https://atta.szlcsc.com/upload/public/pdf/source/20180613/C233285_B82B48E7113DD15BB0DB65002027213C.pdf; Supplier: LCSC
R91-R93 R103 R104 = 0402WGF1001TCE: Type:Thick Film Resistors Resistance: Tolerance:±1% Tolerance:±1% Power(Watts): Temperature Coefficient:±100ppm/℃ Temperature Coefficient:±100ppm/℃ Overload Voltage (Max): Operating Temperature Range:-55℃~+155℃ Operating Temperature Range:-55℃~+155℃; LCSC Part Name: 1kΩ±1%62.5mW; Supplier Part: C11702; Manufacturer: UNI-ROYAL(厚声); Supplier Footprint: 0402; JLCPCB Part Class: BasicPart; Datasheet: https://atta.szlcsc.com/upload/public/pdf/source/20200306/C422600_1E6D84923E4A46A82E41ADD87F860B5C.pdf; Supplier: LCSC; Type: ThickFilmResistors; Tolerance: ±1%; Temperature Coefficient: ±100ppm/℃; Operating Temperature Range: -55℃~+155℃
R105 R106 = 0402WGF2203TCE: Type:Thick Film Resistors Resistance:220kΩ Tolerance:±1% Tolerance:±1% Power(Watts): Overload Voltage (Max): Temperature Coefficient:±100ppm/℃ Temperature Coefficient:±100ppm/℃ Operating Temperature Range:-55℃~+155℃ Operating Temperature Range:-55℃~+155℃; LCSC Part Name: 220kΩ ±1% 62.5mW 厚膜电阻; Supplier Part: C25767; Manufacturer: UNI-ROYAL(厚声); Supplier Footprint: 0402; JLCPCB Part Class: Extended Part; Datasheet: https://atta.szlcsc.com/upload/public/pdf/source/20200306/C422600_1E6D84923E4A46A82E41ADD87F860B5C.pdf; Supplier: LCSC; Type: Thick Film Resistors; Tolerance: ±1%; Temperature Coefficient: ±100ppm/℃; Operating Temperature Range: -55℃~+155℃
R48 R52 R54-R56 R76 R110-R113 R119-R122 R124 = 0402WGF1002TCE: Type:Thick Film Resistors Resistance: Tolerance:±1% Tolerance:±1% Power(Watts): Temperature Coefficient:±100ppm/℃ Temperature Coefficient:±100ppm/℃ Overload Voltage (Max): Operating Temperature Range:-55℃~+155℃ Operating Temperature Range:-55℃~+155℃; LCSC Part Name: 10kΩ±1%62.5mW; Supplier Part: C25744; Manufacturer: UNI-ROYAL(厚声); Supplier Footprint: 0402; JLCPCB Part Class: BasicPart; Datasheet: https://atta.szlcsc.com/upload/public/pdf/source/20200306/C422600_1E6D84923E4A46A82E41ADD87F860B5C.pdf; Supplier: LCSC; Type: ThickFilmResistors; Tolerance: ±1%; Temperature Coefficient: ±100ppm/℃; Operating Temperature Range: -55℃~+155℃
R123 = 0402WGF2701TCE: Type:Thick Film Resistors Resistance:2.7kΩ Tolerance:±1% Tolerance:±1% Power(Watts): Overload Voltage (Max): Temperature Coefficient:±100ppm/℃ Temperature Coefficient:±100ppm/℃ Operating Temperature Range:-55℃~+155℃ Operating Temperature Range:-55℃~+155℃; LCSC Part Name: 2.7kΩ ±1% 62.5mW 厚膜电阻; Supplier Part: C25885; Manufacturer: UNI-ROYAL(厚声); Supplier Footprint: 0402; JLCPCB Part Class: Extended Part; Datasheet: https://atta.szlcsc.com/upload/public/pdf/source/20200306/C422600_1E6D84923E4A46A82E41ADD87F860B5C.pdf; Supplier: LCSC; Type: Thick Film Resistors; Tolerance: ±1%; Temperature Coefficient: ±100ppm/℃; Operating Temperature Range: -55℃~+155℃
RADIO = SI4705-D60-GMR: Supplier Part: C2654632; Manufacturer: SKYWORKS/SILICON LABS(芯科); Supplier Footprint: QFN-20-EP(3x3); JLCPCB Part Class: Extended Part; Datasheet: https://atta.szlcsc.com/upload/public/pdf/source/20210603/097935DFE49676B16CAB25B24893A3FB.pdf; Supplier: LCSC
AAA_PWR RUMBLER SPEAKER = HDR-M_2.54_1x2P: Supplier Footprint: Through
TP1-TP7 = Test-Point: Test Point 测试点
X1 X2 = Q13FC13500004_C32346: Crystal Type:Surface Mount Crystal Frequency: Normal temperature Frequency Tolerance:±20ppm Normal temperature Frequency Tolerance:±20ppm Load Capacitor: Equivalent Series Resistance (ESR):70kΩ Operating Temperature: Operating Temperature:; LCSC Part Name: 32.768kHz ±20ppm 12.5pF; Supplier Part: C32346; Manufacturer: EPSON(爱普生); Manufacturer Part: Q13FC13500004; Supplier Footprint: SMD3215-2P; JLCPCB Part Class: Basic Part; Datasheet: https://atta.szlcsc.com/upload/public/pdf/source/20240418/0E0FF5F0356BA3753F616001439D1416.pdf; Supplier: LCSC; Crystal Type: Surface Mount Crystal; Normal temperature Frequency Tolerance: ±20ppm; Equivalent Series Resistance (ESR): 70kΩ
CARTRIDGE = RCKid2 Cartridge Connector Female
DEBUG = HDR-M_2.54_1x5P: Supplier Footprint: Through
DISPLAY = FPC-05FB-40PH20: Locking Feature:Clamshell Contact Type:Double-sided contacts/up and down connection Number of Contacts:40P Pitch:0.5mm Mounting Type:卧贴 FFC, FCB Thickness:0.3mm FFC, FCB Thickness:0.3mm Height Above Board:2mm Operating Temperature Range:-25℃~+85℃ Operatin; LCSC Part Name: 间距:0.5mm P数:40P 翻盖式 双侧触点/上下接; Supplier Part: C2856837; Manufacturer: XUNPU(讯普); Supplier Footprint: SMD,P=0.5mm,卧贴; JLCPCB Part Class: Extended Part; Datasheet: https://atta.szlcsc.com/upload/public/pdf/source/20210922/C2856837_A0FF02895414764A7F2E525E58748FC4.pdf; Supplier: LCSC; Locking Feature: Clamshell; Contact Type: Double-sided contacts/up and down connection; Number of Contacts: 40P; Pitch: 0.5mm; Mounting Type: 卧贴; FFC, FCB Thickness: 0.3mm; Height Above Board: 2mm; Operating Temperature Range: -25℃~+85℃
R57 R58 = 0402WGF5101TCE: Type:Thick Film Resistors Resistance: Tolerance:±1% Tolerance:±1% Power(Watts): Temperature Coefficient:±100ppm/℃ Temperature Coefficient:±100ppm/℃ Overload Voltage (Max): Operating Temperature Range:-55℃~+155℃ Operating Temperature Range:-55℃~+155℃; LCSC Part Name: 5.1kΩ ±1% 62.5mW; Supplier Part: C25905; Manufacturer: UNI-ROYAL(厚声); Supplier Footprint: 0402; JLCPCB Part Class: Basic Part; Datasheet: https://atta.szlcsc.com/upload/public/pdf/source/20200306/C422600_1E6D84923E4A46A82E41ADD87F860B5C.pdf; Supplier: LCSC; Type: Thick Film Resistors; Tolerance: ±1%; Temperature Coefficient: ±100ppm/℃; Operating Temperature Range: -55℃~+155℃
USB = TYPE-C-F02C-1BBWC1.6: Connector Type:Type-C Gender:Female Mounting Style:Sinking plate Number of Contacts:16P Current Rating - Power (Max):5A Operating Temperature Range:-40℃~+85℃ Operating Temperature Range:-40℃~+85℃ Soldering Temperature(Max):260℃; LCSC Part Name: Type-C 母 沉板; Supplier Part: C20883026; Manufacturer: XYECONN(辛译); Supplier Footprint: SMD; JLCPCB Part Class: Extended Part; Datasheet: https://atta.szlcsc.com/upload/public/pdf/source/20240301/28CF3C13A313A955B2BAF562EF1FF25A.pdf; Supplier: LCSC; Connector Type: Type-C; Gender: Female; Mounting Style: Sinking plate; Number of Contacts: 16P; Current Rating - Power (Max): 5A; Operating Temperature Range: -40℃~+85℃; Soldering Temperature(Max): 260℃
A1 B1-B3 BOTTOM1 LEFT1 RIGHT1 TOP1 = SKRRACE010: Contact Current:50mA Voltage Rating (DC):12V Circuit:SPST Mounting Style:Brick nogging Actuator Style:Round Button With Lamp:- Mechanical Life:- Switch Length:7mm Switch Width:6.2mm Switch Height:0.6mm; LCSC Part Name: 7*6.2*0.6mm 立贴 轻触开关; Supplier Part: C139798; Manufacturer: ALPSALPINE(阿尔卑斯阿尔派); Supplier Footprint: SMD; JLCPCB Part Class: Extended Part; Datasheet: https://atta.szlcsc.com/upload/public/pdf/source/20180118/C139798_15162575632131279491.pdf; Supplier: LCSC; Contact Current: 50mA; Voltage Rating (DC): 12V; Circuit: SPST; Mounting Style: Brick nogging; Actuator Style: Round Button; Switch Length: 7mm; Switch Width: 6.2mm; Switch Height: 0.6mm
AVR = ATTINY3217-MFR: Supplier Part: C617969; Manufacturer: MICROCHIP(美国微芯); Supplier Footprint: WQFN-24-EP(4x4); JLCPCB Part Class: Extended Part; Datasheet: https://atta.szlcsc.com/upload/public/pdf/source/20221017/C07D66C14B922F573E9000C75FCA8F84.pdf; Supplier: LCSC
D4-D12 D14 D15 D17 = 1N5819WS_C191023: Reverse Voltage (Vr):40V Average Rectified Current (Io):1A Forward Voltage (Vf@If):600mV@1A; LCSC Part Name: 40V1A600mV@1A; Supplier Part: C191023; Manufacturer: Hottech(合科泰); Supplier Footprint: SOD-323; JLCPCB Part Class: BasicPart; Datasheet: https://atta.szlcsc.com/upload/public/pdf/source/20220428/3CB86FD8D28D653594B4E35F9D5AEFD9.pdf; Supplier: LCSC; Reverse Voltage (Vr): 40V; Average Rectified Current (Io): 1A; Forward Voltage (Vf@If): 600mV@1A
HOME1 VOL_DOWN VOL_UP = B3U-3000PM-B: Contact Current:50mA Voltage Rating (DC):12V Circuit:SPST Mounting Style:Surface Mount Actuator Style:Round Button With Lamp:- Mechanical Life:- Switch Length:3mm Switch Width:3.2mm Switch Height:0.7mm; LCSC Part Name: 3*3.2*0.7mm 卧贴 轻触开关; Supplier Part: C306884; Manufacturer: OMRON(欧姆龙); Supplier Footprint: SMD; JLCPCB Part Class: Extended Part; Datasheet: https://atta.szlcsc.com/upload/public/pdf/source/20180930/C306884_E0E7E375B2E6233E7BD1A69E17142907.pdf; Supplier: LCSC; Contact Current: 50mA; Voltage Rating (DC): 12V; Circuit: SPST; Mounting Style: Surface Mount; Actuator Style: Round Button; Switch Length: 3mm; Switch Width: 3.2mm; Switch Height: 0.7mm
LED7 LED8 LED10-LED12 = XL-1615RGBC-WS2812B: Emitted Color:RGB Forward Voltage (VF):3.5V~5.5V Forward Voltage (VF):3.5V~5.5V Power Dissipation:- Forward Current:5mA Dominant Wavelength:465nm~470nm；620nm~625nm；525nm~530nm Dominant Wavelength:465nm~470nm；620nm~625nm；525nm~530nm Peak Wavelength:- Lens; LCSC Part Name: 幻彩透明; Supplier Part: C5349954; Manufacturer: XINGLIGHT(成兴光); Supplier Footprint: 1615; JLCPCB Part Class: Extended Part; Datasheet: https://atta.szlcsc.com/upload/public/pdf/source/20231130/04B49B18F8461F82D29B9C7D48853943.pdf; Supplier: LCSC; Emitted Color: RGB; Forward Voltage (VF): 3.5V~5.5V; Forward Current: 5mA; Dominant Wavelength: 465nm~470nm；620nm~625nm；525nm~530nm; Lens Color: 无色透明透镜; Luminous Intensity: 110mcd；130mcd；360mcd; Viewing Angle: 120°; Mounting Sytle: 正贴; Operating Temperature: -20℃~+85℃
Q6 Q9 = AO3400A_C20917: Type: Drain Source Voltage (Vdss): Continuous Drain Current (Id): Power Dissipation (Pd): Drain Source On Resistance (RDS(on)@Vgs,Id):26.5mΩ@10V,5.7A Gate Threshold Voltage (Vgs(th)@Id):1.5V@250uA; LCSC Part Name: N沟道30V5.7A; Supplier Part: C20917; Manufacturer: AOS; Supplier Footprint: SOT-23-3L; JLCPCB Part Class: BasicPart; Datasheet: https://atta.szlcsc.com/upload/public/pdf/source/20140107/1457706668533.pdf; Supplier: LCSC; Drain Source On Resistance (RDS(on)@Vgs,Id): 26.5mΩ@10V,5.7A; Gate Threshold Voltage (Vgs(th)@Id): 1.5V@250uA
R84 = WR04W5R11FTL: Type:Thick Film Resistors Resistance: Tolerance:±1% Tolerance:±1% Power(Watts): Overload Voltage (Max): Temperature Coefficient:-200ppm/℃~+400ppm/℃ Temperature Coefficient:-200ppm/℃~+400ppm/℃ Operating Temperature Range:-55℃~+155℃ Operating Temperature Ra; LCSC Part Name: 厚膜电阻 5.11Ω ±1% 62.5mW; Supplier Part: C396142; Manufacturer: Walsin(华新科); Supplier Footprint: 0402; JLCPCB Part Class: Extended Part; Datasheet: https://atta.szlcsc.com/upload/public/pdf/source/20191217/C470037_D99261402F77DA8B1D609223749D445A.pdf; Supplier: LCSC; Type: Thick Film Resistors; Tolerance: ±1%; Temperature Coefficient: -200ppm/℃~+400ppm/℃; Operating Temperature Range: -55℃~+155℃
R87 R88 = 0402WGF4700TCE: Type:Thick Film Resistors Resistance: Tolerance:±1% Tolerance:±1% Power(Watts): Temperature Coefficient:±100ppm/℃ Temperature Coefficient:±100ppm/℃ Overload Voltage (Max): Operating Temperature Range:-55℃~+155℃ Operating Temperature Range:-55℃~+155℃; LCSC Part Name: 470Ω±1%62.5mW; Supplier Part: C25117; Manufacturer: UNI-ROYAL(厚声); Supplier Footprint: 0402; JLCPCB Part Class: BasicPart; Datasheet: https://atta.szlcsc.com/upload/public/pdf/source/20200306/C422600_1E6D84923E4A46A82E41ADD87F860B5C.pdf; Supplier: LCSC; Type: ThickFilmResistors; Tolerance: ±1%; Temperature Coefficient: ±100ppm/℃; Operating Temperature Range: -55℃~+155℃
U33 = SN74LVC1T45DBVR: Channel Type:Bi-Directional Data Rate:420Mbps Supply Voltage (VCCA):1.65V~5.5V Supply Voltage (VCCA):1.65V~5.5V Supply Voltage (VCCB):1.65V~5.5V Supply Voltage (VCCB):1.65V~5.5V Number of Circuits:1 Channels per Circuit:1 Output Type:非反相；Tri-State Operati; Supplier Part: C7843; Manufacturer: TI(德州仪器); Supplier Footprint: SOT-23-6; JLCPCB Part Class: Extended Part; Datasheet: https://www.ti.com/cn/lit/gpn/sn74lvc1t45; Supplier: LCSC; Channel Type: Bi-Directional; Data Rate: 420Mbps; Supply Voltage (VCCA): 1.65V~5.5V; Supply Voltage (VCCB): 1.65V~5.5V; Number of Circuits: 1; Channels per Circuit: 1; Output Type: 非反相；Tri-State; Operating Temperature: -40℃~+85℃
C132 C215 C216 C228 C229 = CL10A226MQ8NRNC: Capacitance: Tolerance:±20% Tolerance:±20% Voltage Rated: Temperature Coefficient:; LCSC Part Name: 22uF±20%6.3V; Supplier Part: C59461; Manufacturer: SAMSUNG(三星); Supplier Footprint: 0603; JLCPCB Part Class: BasicPart; Datasheet: https://atta.szlcsc.com/upload/public/pdf/source/20160103/1457707740762.pdf; Supplier: LCSC; Tolerance: ±20%
L15 = IP4252CZ16-8-TTL,1: Supplier Part: C458218; Manufacturer: Nexperia(安世); Supplier Footprint: UDFN-16-EP(1.4x3.3); JLCPCB Part Class: Extended Part; Datasheet: https://atta.szlcsc.com/upload/public/pdf/source/20191127/C461172_525550BE1F83C1B61EE5D9157686BE2E.pdf; Supplier: LCSC
microSD = TF-01A_C91145: Card Connection Mode:Self-bouncing Card Type:MicroSD card (TF card) Connector Type:Card Slot Additional Card Detection Pins:- Supplementary Features:With Locating Pin Maximum Body Height:1.85mm Operating Temperature Range:- Operating Temperature Range:-; LCSC Part Name: 自弹式 MicroSD卡(TF卡) 卡座; Supplier Part: C91145; Manufacturer: 韩国韩荣; Supplier Footprint: SMD; JLCPCB Part Class: Extended Part; Datasheet: https://atta.szlcsc.com/upload/public/pdf/source/20190322/C91145_63CBD6FB4639A3A3EC6A9721F18AE0FB.pdf; Supplier: LCSC; Card Connection Mode: Self-bouncing; Card Type: MicroSD card (TF card); Connector Type: Card Slot; Supplementary Features: With Locating Pin; Maximum Body Height: 1.85mm
R45 R46 = 0402WGF2201TCE: Type:Thick Film Resistors Resistance: Tolerance:±1% Tolerance:±1% Power(Watts): Temperature Coefficient:±100ppm/℃ Temperature Coefficient:±100ppm/℃ Overload Voltage (Max): Operating Temperature Range:-55℃~+155℃ Operating Temperature Range:-55℃~+155℃; LCSC Part Name: 2.2kΩ±1%62.5mW; Supplier Part: C25879; Manufacturer: UNI-ROYAL(厚声); Supplier Footprint: 0402; JLCPCB Part Class: BasicPart; Datasheet: https://atta.szlcsc.com/upload/public/pdf/source/20200306/C422600_1E6D84923E4A46A82E41ADD87F860B5C.pdf; Supplier: LCSC; Type: ThickFilmResistors; Tolerance: ±1%; Temperature Coefficient: ±100ppm/℃; Operating Temperature Range: -55℃~+155℃
U40 = TS5A23159RSER: Switch Circuit:SPDT(SPDT) Number of Channels:2 Supply Voltage:1.65V~5.5V Supply Voltage:1.65V~5.5V Turn-on time:28ns On-State Resistance (Max):1.7Ω Turn-off time:9ns Operating Temperature:-40℃~+85℃ Operating Temperature:-40℃~+85℃; LCSC Part Name: TS5A23159 1-Q 2-通道 SPDT 模拟开关; Supplier Part: C138710; Manufacturer: TI(德州仪器); Supplier Footprint: UQFN-10-EP(1.5x2); JLCPCB Part Class: Extended Part; Datasheet: https://www.ti.com/cn/lit/gpn/ts5a23159; Supplier: LCSC; Switch Circuit: SPDT(SPDT); Number of Channels: 2; Supply Voltage: 1.65V~5.5V; Turn-on time: 28ns; On-State Resistance (Max): 1.7Ω; Turn-off time: 9ns; Operating Temperature: -40℃~+85℃
3V3 VDD = TPS62825DMQT: Function:Step-down type Output Type:Adjustable Input Voltage:2.4V~5.5V Input Voltage:2.4V~5.5V Output Voltage:600mV~4V Output Voltage:600mV~4V Output Current (Max):2A Switching Frequency:2.2MHz Operating Temperature:-40℃~+125℃@(TJ) Operating Temperature:-; Supplier Part: C3189970; Manufacturer: TI(德州仪器); Supplier Footprint: VSON-6(1.5x1.5); JLCPCB Part Class: Extended Part; Datasheet: https://www.ti.com/cn/lit/gpn/tps62826; Supplier: LCSC; Function: Step-down type; Output Type: Adjustable; Input Voltage: 2.4V~5.5V; Output Voltage: 600mV~4V; Output Current (Max): 2A; Switching Frequency: 2.2MHz; Operating Temperature: -40℃~+125℃@(TJ); Synchronous Rectification: Yes; Number of Outputs: 1; Topology: Step-down; Switch tube (built-in/external): 内置
5V = HX4002-MFC: Function:Charge pump Synchronous Rectification:NO Number of Outputs:1 Topology:- Input Voltage:2.7V~5.5V Input Voltage:2.7V~5.5V Output Voltage:5V Output Voltage:5V Output Current (Max):250mA Switching Frequency:1.2MHz; LCSC Part Name: 电荷泵Vin=2.7V~5.5VVout=5V250mA; Supplier Part: C172354; Manufacturer: HEXIN(禾芯微); Supplier Footprint: SOT-23-6; JLCPCB Part Class: ExtendedPart; Datasheet: https://atta.szlcsc.com/upload/public/pdf/source/20180202/C172354_15175649156801336361.pdf; Supplier: LCSC; Function: Chargepump; Synchronous Rectification: NO; Number of Outputs: 1; Input Voltage: 2.7V~5.5V; Output Current (Max): 250mA; Switching Frequency: 1.2MHz
BATT = HDR-M_2.54_1x4P: Supplier Footprint: Through
C81 C82 = CL10A106MA8NRNC: Capacitance: Tolerance:±20% Tolerance:±20% Voltage Rated: Temperature Coefficient:; LCSC Part Name: 10uF±20%25V; Supplier Part: C96446; Manufacturer: SAMSUNG(三星); Supplier Footprint: 0603; JLCPCB Part Class: BasicPart; Datasheet: https://atta.szlcsc.com/upload/public/pdf/source/20170325/1490427913016.pdf; Supplier: LCSC; Tolerance: ±20%
C83 = CL10A225KO8NNNC: Capacitance: Tolerance:±10% Tolerance:±10% Voltage Rated: Temperature Coefficient:; LCSC Part Name: 2.2uF±10%16V; Supplier Part: C23630; Manufacturer: SAMSUNG(三星); Supplier Footprint: 0603; JLCPCB Part Class: BasicPart; Datasheet: https://atta.szlcsc.com/upload/public/pdf/source/20160103/1457707709512.pdf; Supplier: LCSC; Tolerance: ±10%
C210-C214 C224 C225 = CL05A475MP5NRNC: Capacitance: Tolerance:±20% Tolerance:±20% Voltage Rated: Temperature Coefficient:; LCSC Part Name: 4.7uF±20%10V; Supplier Part: C23733; Manufacturer: SAMSUNG(三星); Supplier Footprint: 0402; JLCPCB Part Class: BasicPart; Datasheet: https://atta.szlcsc.com/upload/public/pdf/source/20160103/1457707710457.pdf; Supplier: LCSC; Tolerance: ±20%
C219-C221 = CL10A106KP8NNNC: Capacitance: Tolerance:±10% Tolerance:±10% Voltage Rated: Temperature Coefficient:; LCSC Part Name: 10uF ±10% 10V; Supplier Part: C19702; Manufacturer: SAMSUNG(三星); Supplier Footprint: 0603; JLCPCB Part Class: Basic Part; Datasheet: https://atta.szlcsc.com/upload/public/pdf/source/20160218/1457707763339.pdf; Supplier: LCSC; Tolerance: ±10%
C243 = CL10B473KB8NNNC: Capacitance: Tolerance:±10% Tolerance:±10% Voltage Rated: Temperature Coefficient:; LCSC Part Name: 47nF±10%50V; Supplier Part: C1622; Manufacturer: SAMSUNG(三星); Supplier Footprint: 0603; JLCPCB Part Class: BasicPart; Datasheet: https://atta.szlcsc.com/upload/public/pdf/source/20160103/1457707684971.pdf; Supplier: LCSC; Tolerance: ±10%
D16 = BAT60JFILM: Forward Voltage (Vf@If):580mV@1A Reverse Voltage (Vr):10V Average Rectified Current (Io):3A Reverse Leakage Current (Ir):6uA@10V; LCSC Part Name: 电压:10V 电流:3A; Supplier Part: C133103; Manufacturer: ST(意法半导体); Supplier Footprint: SOD-323; JLCPCB Part Class: Extended Part; Datasheet: https://atta.szlcsc.com/upload/public/pdf/source/20171026/C133103_15089839830161058837.pdf; Supplier: LCSC; Forward Voltage (Vf@If): 580mV@1A; Reverse Voltage (Vr): 10V; Average Rectified Current (Io): 3A; Reverse Leakage Current (Ir): 6uA@10V
L17 = IHLP1212BZER2R2M11: Inductance: Tolerance:±20% Tolerance:±20% Rated Current: Saturation Current (Isat):3.3A DC Resistance (DCR): Type:- Ratings:-; LCSC Part Name: 2.2uH ±20% 3.3A; Supplier Part: C553996; Manufacturer: VISHAY(威世); Supplier Footprint: SMD; JLCPCB Part Class: Extended Part; Datasheet: https://atta.szlcsc.com/upload/public/pdf/source/20210201/C553996_2AB0AFEEFF1E1AB22554D6AE694AD6DF.pdf; Supplier: LCSC; Tolerance: ±20%; Saturation Current (Isat): 3.3A
PWR = BQ25895RTWR: Supplier Part: C80200; Manufacturer: TI(德州仪器); Supplier Footprint: QFN-24(4x4); JLCPCB Part Class: ExtendedPart; Datasheet: https://atta.szlcsc.com/upload/public/pdf/source/20171123/C80200_15114362377651139443.pdf; Supplier: LCSC
Q8 = AO3401A_C15127: Type: Drain Source Voltage (Vdss): Continuous Drain Current (Id): Power Dissipation (Pd): Drain Source On Resistance (RDS(on)@Vgs,Id):44mΩ@10V,4.3A Gate Threshold Voltage (Vgs(th)@Id):1.3V@250uA; LCSC Part Name: P沟道 30V 4A; Supplier Part: C15127; Manufacturer: AOS; Supplier Footprint: SOT-23-3L; JLCPCB Part Class: Basic Part; Datasheet: https://atta.szlcsc.com/upload/public/pdf/source/20160507/1462613609053.pdf; Supplier: LCSC; Drain Source On Resistance (RDS(on)@Vgs,Id): 44mΩ@10V,4.3A; Gate Threshold Voltage (Vgs(th)@Id): 1.3V@250uA
R115 R116 = 0402WGF1003TCE: Type:Thick Film Resistors Resistance: Tolerance:±1% Tolerance:±1% Power(Watts): Temperature Coefficient:±100ppm/℃ Temperature Coefficient:±100ppm/℃ Overload Voltage (Max): Operating Temperature Range:-55℃~+155℃ Operating Temperature Range:-55℃~+155℃; LCSC Part Name: 100kΩ±1%62.5mW; Supplier Part: C25741; Manufacturer: UNI-ROYAL(厚声); Supplier Footprint: 0402; JLCPCB Part Class: BasicPart; Datasheet: https://atta.szlcsc.com/upload/public/pdf/source/20200306/C422600_1E6D84923E4A46A82E41ADD87F860B5C.pdf; Supplier: LCSC; Type: ThickFilmResistors; Tolerance: ±1%; Temperature Coefficient: ±100ppm/℃; Operating Temperature Range: -55℃~+155℃
R117 R118 = FRC0402F4503TS: Type:Thick Film Resistors Resistance:450kΩ Tolerance:±1% Tolerance:±1% Power(Watts): Overload Voltage (Max): Temperature Coefficient:±100ppm/℃ Temperature Coefficient:±100ppm/℃; LCSC Part Name: 450kΩ ±1% 62.5mW 厚膜电阻; Supplier Part: C5159688; Manufacturer: FOJAN(富捷); Supplier Footprint: 0402; JLCPCB Part Class: Extended Part; Datasheet: https://atta.szlcsc.com/upload/public/pdf/source/20211221/925EC7D7225764EE0046F22065062C87.pdf; Supplier: LCSC; Type: Thick Film Resistors; Tolerance: ±1%; Temperature Coefficient: ±100ppm/℃
R125 = 0402WGF2402TCE: Type:Thick Film Resistors Resistance:24kΩ Tolerance:±1% Tolerance:±1% Power(Watts): Overload Voltage (Max): Temperature Coefficient:±100ppm/℃ Temperature Coefficient:±100ppm/℃ Operating Temperature Range:-55℃~+155℃ Operating Temperature Range:-55℃~+155℃; LCSC Part Name: 24kΩ ±1% 62.5mW 厚膜电阻; Supplier Part: C25769; Manufacturer: UNI-ROYAL(厚声); Supplier Footprint: 0402; JLCPCB Part Class: Extended Part; Datasheet: https://atta.szlcsc.com/upload/public/pdf/source/20200306/C422600_1E6D84923E4A46A82E41ADD87F860B5C.pdf; Supplier: LCSC; Type: Thick Film Resistors; Tolerance: ±1%; Temperature Coefficient: ±100ppm/℃; Operating Temperature Range: -55℃~+155℃
R126 = 0805W8F3003T5E: Type:Thick Film Resistors Resistance:300kΩ Tolerance:±1% Tolerance:±1% Power(Watts): Overload Voltage (Max): Temperature Coefficient:±100ppm/℃ Temperature Coefficient:±100ppm/℃ Operating Temperature Range:-55℃~+155℃ Operating Temperature Range:-55℃~+155℃; LCSC Part Name: 300kΩ ±1% 125mW 厚膜电阻; Supplier Part: C17616; Manufacturer: UNI-ROYAL(厚声); Supplier Footprint: 0805; JLCPCB Part Class: Extended Part; Datasheet: https://atta.szlcsc.com/upload/public/pdf/source/20200306/C422600_1E6D84923E4A46A82E41ADD87F860B5C.pdf; Supplier: LCSC; Type: Thick Film Resistors; Tolerance: ±1%; Temperature Coefficient: ±100ppm/℃; Operating Temperature Range: -55℃~+155℃
R127 = 0805W8F5603T5E: Type:Thick Film Resistors Resistance:560kΩ Tolerance:±1% Tolerance:±1% Power(Watts): Overload Voltage (Max): Temperature Coefficient:±100ppm/℃ Temperature Coefficient:±100ppm/℃ Operating Temperature Range:-55℃~+155℃ Operating Temperature Range:-55℃~+155℃; LCSC Part Name: 560kΩ ±1% 125mW 厚膜电阻; Supplier Part: C15785; Manufacturer: UNI-ROYAL(厚声); Supplier Footprint: 0805; JLCPCB Part Class: Extended Part; Datasheet: https://atta.szlcsc.com/upload/public/pdf/source/20200306/C422600_1E6D84923E4A46A82E41ADD87F860B5C.pdf; Supplier: LCSC; Type: Thick Film Resistors; Tolerance: ±1%; Temperature Coefficient: ±100ppm/℃; Operating Temperature Range: -55℃~+155℃
USB1 USB2 = TFM201610ALC-R47MTAA: Inductance: Tolerance:±20% Tolerance:±20% Rated Current:- Saturation Current (Isat):5.1A DC Resistance (DCR): Q @ Freq:- Frequency - Self Resonant:- Ratings:; LCSC Part Name: 470nH ±20% 5.1A; Supplier Part: C2045043; Manufacturer: TDK; Supplier Footprint: 0806; JLCPCB Part Class: Extended Part; Datasheet: https://atta.szlcsc.com/upload/public/pdf/source/20210603/B6909FD921DE33B245D498B0D096D011.pdf; Supplier: LCSC; Tolerance: ±20%; Saturation Current (Isat): 5.1A
C153 C154 = 0402CG150J500NT: Capacitance: Tolerance:±5% Tolerance:±5% Voltage Rated: Temperature Coefficient:; LCSC Part Name: 15pF ±5% 50V; Supplier Part: C1548; Manufacturer: FH(风华); Supplier Footprint: 0402; JLCPCB Part Class: Basic Part; Datasheet: https://atta.szlcsc.com/upload/public/pdf/source/20200305/C486355_26A10D38EF8C2A5C37091D0039909270.pdf; Supplier: LCSC; Tolerance: ±5%
L16 = AOTA-B201610S3R3-101-T: Supplier Part: C42411119; Manufacturer: ABRACON; Supplier Footprint: 0806; JLCPCB Part Class: Extended Part; Datasheet: https://atta.szlcsc.com/upload/public/pdf/source/20241210/8ED7235334351200B2CE75E3CBC0DAAD.pdf; Supplier: LCSC
R50 R51 = 0402WGF220JTCE: Type:Thick Film Resistors Resistance: Tolerance:±1% Tolerance:±1% Power(Watts): Temperature Coefficient:±100ppm/℃ Temperature Coefficient:±100ppm/℃ Overload Voltage (Max): Operating Temperature Range:-55℃~+155℃ Operating Temperature Range:-55℃~+155℃; LCSC Part Name: 厚膜电阻 22Ω ±1% 62.5mW; Supplier Part: C25092; Manufacturer: UNI-ROYAL(厚声); Supplier Footprint: 0402; JLCPCB Part Class: Basic Part; Datasheet: https://atta.szlcsc.com/upload/public/pdf/source/20200306/C422600_1E6D84923E4A46A82E41ADD87F860B5C.pdf; Supplier: LCSC; Type: Thick Film Resistors; Tolerance: ±1%; Temperature Coefficient: ±100ppm/℃; Operating Temperature Range: -55℃~+155℃
R109 = 0402WGF330JTCE: Type:Thick Film Resistors Resistance:33Ω Tolerance:±1% Tolerance:±1% Power(Watts): Overload Voltage (Max): Temperature Coefficient:±100ppm/℃ Temperature Coefficient:±100ppm/℃ Operating Temperature Range:-55℃~+155℃ Operating Temperature Range:-55℃~+155℃; LCSC Part Name: 33Ω ±1% 62.5mW 厚膜电阻; Supplier Part: C25105; Manufacturer: UNI-ROYAL(厚声); Supplier Footprint: 0402; JLCPCB Part Class: Basic Part; Datasheet: https://atta.szlcsc.com/upload/public/pdf/source/20200306/C422600_1E6D84923E4A46A82E41ADD87F860B5C.pdf; Supplier: LCSC; Type: Thick Film Resistors; Tolerance: ±1%; Temperature Coefficient: ±100ppm/℃; Operating Temperature Range: -55℃~+155℃
RP2350B = RP2350B: Supplier Part: C9900136713; Supplier Footprint: QFN80; Supplier: LCSC
U39 = ABM8-272-T3_C20625731: LCSC Part Name: 推荐配套使用产品C20625731 ABM8-272-T3 与 C2040 RP2040; Supplier Part: C20625731; Manufacturer: ABRACON; Supplier Footprint: SMD3225-4P; JLCPCB Part Class: Extended Part; Datasheet: https://atta.szlcsc.com/upload/public/pdf/source/20240227/A8BE43F636D80F75C9AF5C59EDF21E9A.pdf; Supplier: LCSC
U26 = BMI160: Supplier Part: C94021; Manufacturer: Bosch(博世); Supplier Footprint: LGA-14; JLCPCB Part Class: Extended Part; Datasheet: https://atta.szlcsc.com/upload/public/pdf/source/20170818/C94021_1503051343757895423.pdf; Supplier: LCSC
U41 = LTR-390UV-01: Supplier Part: C492374; Manufacturer: LITEON(光宝); Supplier Footprint: SMD,2x2x0.7mm; JLCPCB Part Class: Extended Part; Supplier: LCSC

## Nets
3V3: AVR.4(VDD) C95.2 C96.2 C118.2 C228.2 C230.2 C234.2 C235.2 R45.2 R46.2 R117.2 R124.2 U26.5(VDDIO) U26.8(VDD) U26.12(CSB) U33.1(VCCA) U33.5(DIR) U40.8(VCC) U41.1(VDD) USB1.2
5V: 5V.1(VOUT) C82.2 C101.2 C102.2 C104.2 C143.2 C144.2 LED7.2(VDD) LED8.2(VDD) LED10.2(VDD) LED11.2(VDD) LED12.2(VDD) U33.6(VCCB)
5V_ON: 5V.3(EN) AVR.21(PC4) R48.1
DVDD: C114.2 C115.2 C210.2 C212.2 L16.2 RP2350B.10(DVDD) RP2350B.32(DVDD) RP2350B.51(DVDD) RP2350B.65(VREG_FB)
GND: 3V3.4(GND) 5V.2(GND) AMP.7(GND) AMP.9(EP) AUDIO.7(IOVSS) AUDIO.12(SPI_SELECT) AUDIO.17(AVSS) AUDIO.28(DVSS) AVR.3(GND) AVR.25(GND) BATT.1 BATT.2 C81.1 C82.1 C95.1 C96.1 C101.1 C102.1 C104.1 C107.1 C108.1 C109.1 C110.1 C111.1 C112.1 C114.1 C115.1 C116.1 C117.1 C118.1 C132.1 C143.1 C144.1 C153.2 C154.2 C167.1 C191.1 C192.1 C201.2 C202.2 C203.2 C204.2 C208.1 C209.1 C210.1 C211.1 C212.1 C213.2 C214.1 C215.1 C216.1 C218.1 C219.1 C220.1 C221.1 C224.1 C225.1 C228.1 C229.1 C232.1 C233.1 C234.1 C235.1 C236.1 C237.2 C238.2 C239.1 C244.1 CARTRIDGE.10(GND) CARTRIDGE.13(GND) CARTRIDGE.14(GND) DEBUG.3 L15.17(EP) L18.2 L19.2 LED7.3(GND) LED8.3(GND) LED10.3(GND) LED11.3(GND) LED12.3(GND) microSD.6(VSS) microSD.10(GND) microSD.11(GND) PWR.17(PGND) PWR.18(PGND) PWR.25(PAD) Q6.2(S) Q9.2(S) R48.2 R52.1 R54.2 R55.2 R57.2 R58.2 R104.1 R110.2 R111.2 R113.2 R115.1 R116.1 R119.2 R120.2 R121.2 R122.2 R125.2 R127.1 RADIO.3(RFGND) RADIO.6(SEN#) RADIO.12(GND) RP2350B.62(VREG_PGND) RP2350B.81(GND) U26.1(SDO) U26.6(GNDIO) U26.7(GND) U33.2(GND) U39.2(GND) U39.4(GND) U40.3(GND) U41.3(GND) USB.A12B1(GND) USB.B12A1(GND) VDD.4(GND)
VBATT: BATT.3 BATT.4 C221.2 PWR.13(BAT) PWR.14(BAT) Q8.3(D) R126.2
VCC: 3V3.1(EN) 3V3.6(VIN) 5V.5(VIN) AAA_PWR.2 C81.2 C219.2 C220.2 C224.2 C225.2 L17.2 PWR.15(SYS) PWR.16(SYS) VDD.6(VIN)
VDD_EN: AVR.5(PA4) U40.1(IN1) U40.5(IN2) VDD.1(EN)
ACCEL_INT: AVR.22(PC5) U26.9(INT2)
AUDIO_INT: AUDIO.11(MISO/MFP4) RP2350B.2(GPIO5)
AUDIO_MICBIAS: AUDIO.19(MICBIAS) R103.2 R123.2
AUDIO_RESET: AUDIO.31(RESET#) RP2350B.8(GPIO10)
AVR_INT: AVR.20(PC3) RP2350B.80(GPIO3)
AVR_TX: AVR.24(PA1) DEBUG.1
BTN_1: AVR.12(PB4) D5.2(A) D9.2(A) D17.2(A)
BTN_2: AVR.9(PB7) D6.2(A) D10.2(A) D14.2(A)
BTN_3: AVR.10(PB6) D7.2(A) D11.2(A) D15.2(A)
BTN_4: AVR.6(PA5) D8.2(A) D12.2(A)
BTN_ABXY: A1.2 A1.4 AVR.8(PA7) B1.2 B1.4 B2.2 B2.4 B3.2 B3.4
BTN_CTRL: AVR.11(PB5) HOME1.1 VOL_DOWN.2 VOL_UP.2
BTN_DPAD: AVR.19(PC2) BOTTOM1.2 BOTTOM1.4 LEFT1.2 LEFT1.4 RIGHT1.2 RIGHT1.4 TOP1.2 TOP1.4
DB_0: DISPLAY.24(DB0) RP2350B.44(GPIO35)
DB_1: DISPLAY.23(DB1) RP2350B.43(GPIO34)
DB_2: DISPLAY.22(DB2) RP2350B.42(GPIO33)
DB_3: DISPLAY.21(DB3) RP2350B.40(GPIO32)
DB_4: DISPLAY.20(DB4) RP2350B.39(GPIO31)
DB_5: DISPLAY.19(DB5) RP2350B.38(GPIO30)
DB_6: DISPLAY.18(DB6) RP2350B.37(GPIO29)
DB_7: DISPLAY.17(DB7) RP2350B.36(GPIO28)
DB_8: DISPLAY.16(DB8) RP2350B.28(GPIO27)
DB_9: DISPLAY.15(DB9) RP2350B.27(GPIO26)
DB_10: DISPLAY.14(DB10) RP2350B.26(GPIO25)
DB_11: DISPLAY.13(DB11) RP2350B.25(GPIO24)
DB_12: DISPLAY.12(DB12) RP2350B.23(GPIO23)
DB_13: DISPLAY.11(DB13) RP2350B.22(GPIO22)
DB_14: DISPLAY.10(DB14) RP2350B.21(GPIO21)
DB_15: DISPLAY.9(DB15) RP2350B.20(GPIO20)
DISP_CSX: DISPLAY.32(CSX/SPI_CS) RP2350B.48(GPIO39)
DISP_DCX: DISPLAY.31(DCX/SPI_CLK) RP2350B.47(GPIO38)
DISP_LED_K: DISPLAY.5(LED-K) DISPLAY.6(LED-K) DISPLAY.7(LED-K) R84.1
DISP_RDX: DISPLAY.29(RDX) RP2350B.45(GPIO36)
DISP_TE: DISPLAY.33(TE) RP2350B.49(GPIO40_ADC0)
DISP_WRX: DISPLAY.30(WRX/SPI_DC) RP2350B.46(GPIO37)
EMBEDDED_ANTENNA: FMA.1 L19.1 RADIO.4(LPI)
GPIO_11: CARTRIDGE.9(GPIO_11) RP2350B.9(GPIO11)
GPIO_12: CARTRIDGE.8(GPIO_12) RP2350B.11(GPIO12)
GPIO_13: CARTRIDGE.7(GPIO_13) RP2350B.12(GPIO13)
GPIO_14: CARTRIDGE.6(GPIO_14) RP2350B.13(GPIO14)
GPIO_15: CARTRIDGE.5(GPIO_15) RP2350B.14(GPIO15)
GPIO_16: CARTRIDGE.4(GPIO_16) RP2350B.16(GPIO16)
GPIO_17: CARTRIDGE.3(GPIO_17) RP2350B.17(GPIO17)
GPIO_18: CARTRIDGE.2(GPIO_18) RP2350B.18(GPIO18)
GPIO_19: CARTRIDGE.1(GPIO_19) RP2350B.19(GPIO19)
GPIO_47: CARTRIDGE.21(GPIO_47) RP2350B.58(GPIO47_ADC7)
HEADSET_ANTENNA: C242.2 RADIO.2(FMI)
HEADSET_DETECT: AUDIO.8(SCLK/MFP3) C207.2 HEADSET.2 R123.1
HEADSET_LEFT: AUDIO.25(HPL) C199.2
HEADSET_MIC: AUDIO.21(IN3_R) C207.1
HEADSET_RIGHT: AUDIO.27(HPR) C200.2
I2C_SCL: AVR.16(PB0) PWR.5(SCL) R45.1 TP7.1 U26.13(SCX) U40.2(NO1) U41.4(SCL)
I2C_SCL_VDD: AUDIO.9(SCL/SS#) RADIO.7(SCLK) RP2350B.78(GPIO1) U40.10(COM1)
I2C_SDA: AVR.15(PB1) PWR.6(SDA) R46.1 TP6.1 U26.14(SDX) U40.4(NO2) U41.6(SDA)
I2C_SDA_VDD: AUDIO.10(SDA/MOSI) RADIO.8(SDIO) RP2350B.77(GPIO0) U40.6(COM2)
I2S_BCK: AUDIO.2(BCLK) RP2350B.7(GPIO9)
I2S_DIN: AUDIO.4(DIN/MFP1) RP2350B.4(GPIO7)
I2S_DOUT: AUDIO.5(DOUT/MFP2) RP2350B.3(GPIO6)
I2S_LRCK: AUDIO.3(WCLK) RP2350B.6(GPIO8)
IOVDD: AMP.6(VDD) AUDIO.6(IOVDD) AUDIO.26(LDOIN/HPVDD) AUDIO.30(LDO_SELECT) C107.2 C108.2 C109.2 C110.2 C111.2 C112.2 C116.2 C117.2 C132.2 C167.2 C191.2 C192.2 C204.1 C208.2 C209.2 C229.2 C231.2 C236.2 C237.1 CARTRIDGE.11(3V3) CARTRIDGE.12(3V3) D4.1(K) microSD.4(VDD) R56.2 R76.1 R109.1 R118.2 RADIO.10(VD) RADIO.11(VA) RP2350B.5(IOVDD) RP2350B.15(IOVDD) RP2350B.24(IOVDD) RP2350B.29(IOVDD) RP2350B.41(IOVDD) RP2350B.50(IOVDD) RP2350B.60(IOVDD) RP2350B.68(USB_OTP_VDD) RP2350B.69(QSPI_IOVDD) RP2350B.76(IOVDD) RUMBLER.2 USB2.2
MAG_SCL: U26.3(ASCX)
MAG_SDA: U26.2(ASDX)
MIC_N: AUDIO.13(IN1_L) C206.1
MIC_P: AUDIO.14(IN1_R) C205.1
PWM_BACKLIGHT: AVR.17(PC0) R92.2
PWM_RUMBLER: AVR.2(EXTCLK/PA3) R91.2
PWR_INT: AVR.1(PA2) PWR.7(INT) R124.1 R126.1 R127.2
QSPI_SCLK: CARTRIDGE.19(QSPI_SCLK) RP2350B.71(QSPI_SCLK)
QSPI_SD0: CARTRIDGE.18(QSPI_SD0) RP2350B.72(QSPI_SD0)
QSPI_SD1: CARTRIDGE.16(QSPI_SD1) RP2350B.74(QSPI_SD1)
QSPI_SD2: CARTRIDGE.17(QSPI_SD2) RP2350B.73(QSPI_SD2)
QSPI_SD3: CARTRIDGE.20(QSPI_SD3) RP2350B.70(QSPI_SD3)
QSPI_SS: AVR.18(PC1) CARTRIDGE.15(QSPI_SS) R56.1 RP2350B.75(QSPI_SS)
RADIO_INT: RADIO.18(GPO2/[INT#]) RP2350B.1(GPIO4) TP4.1
RADIO_L: AUDIO.15(IN2_L) C240.2
RADIO_R: AUDIO.16(IN2_R) C241.2
RADIO_RESET: RADIO.5(RST#) RP2350B.79(GPIO2)
RGB: AVR.7(PA6) U33.3(A)
RPI_SWCLK: DEBUG.4 RP2350B.33(SWCLK)
RPI_SWD: DEBUG.5 RP2350B.34(SWDIO)
SD_CSN: L15.2(IN2) RP2350B.56(GPIO45_ADC5)
SD_RX: L15.3(IN3) RP2350B.55(GPIO44_ADC4)
SD_SCK: L15.5(IN5) RP2350B.53(GPIO42_ADC2)
SD_TX: L15.4(IN4) RP2350B.54(GPIO43_ADC3)
SDIO_1: L15.6(IN6) RP2350B.52(GPIO41_ADC1)
SDIO_2: L15.1(IN1) RP2350B.57(GPIO46_ADC6)
SPEAKER_EN: AMP.1(#SHUTDOWN) AUDIO.32(GPIO/MFP5)
SPEAKER_N: AUDIO.22(LOL) R105.1
SPEAKER_P: AUDIO.23(LOR) R106.1
UPDI: AVR.23(PA0/RESET#/UPDI) DEBUG.2
USB_DM: R50.1 USB.A7(DN1) USB.B7(DN2)
USB_DP: R51.1 USB.A6(DP1) USB.B6(DP2)
VREG_AVDD: C213.1 R109.2 RP2350B.61(VREG_AVDD)
VREG_LX: L16.1 RP2350B.63(VREG_LX)
VREG_VIN: C211.2 RP2350B.64(VREG_VIN)
VUSB: C218.2 D16.2(A) PWR.1(VBUS) Q8.1(G) R52.2 TP2.1 USB.A9B4(VBUS) USB.B9A4(VBUS)
XIN: C153.1 RP2350B.30(XIN) U39.1
XOUT: R93.1 RP2350B.31(XOUT)
$1N1000: 5V.4(C-) C83.1
$1N1001: 5V.6(C+) C83.2
$1N63321: PWR.2(D+) PWR.3(D–)
$1N63464: C214.2 PWR.22(REGN) R112.1
$1N63472: C243.2 L17.1 PWR.19(SW) PWR.20(SW)
$1N63621: PWR.9(CE) R110.1
$1N63731: C215.2 C216.2 PWR.23(PMID)
$1N64929: C243.1 PWR.21(BTST)
$1N65109: PWR.8(OTG) R111.1
$1N65541: PWR.11(TS) R112.2 R113.1
$1N65681: PWR.10(ILIM) R125.1
$1N67269: 3V3.5(SW) USB1.1
$1N67295: 3V3.3(FB) C230.1 R115.2 R117.1
$1N67403: C231.1 R116.2 R118.1 VDD.3(FB)
$1N67445: USB2.1 VDD.5(SW)
$1N73932: AAA_PWR.1 D16.1(K) Q8.2(S)
$1N75550: PWR.12(QON) TP1.1
$2N19576: L15.14(OUT3) microSD.7(DAT0(D0)) R76.2
$2N25545: L15.16(OUT1) microSD.1(DAT2(RSV))
$2N25554: L15.15(OUT2) microSD.2(CDDAT3(CS))
$2N25581: L15.13(OUT4) microSD.3(CMD(DI))
$2N25588: L15.12(OUT5) microSD.5(CLK(SCLK))
$2N25598: L15.11(OUT6) microSD.8(DAT1(RSV))
$2N27404: R120.1 U40.7(NC2)
$2N27409: R119.1 U40.9(NC1)
$3N64809: AUDIO.18(REF) C201.1
$3N64814: AUDIO.24(AVDD) C202.1
$3N64820: AUDIO.29(DVDD) C203.1
$3N65040: AUDIO.1(MCLK) TP3.1
$3N65354: C205.2 MIC.1(+) R103.1
$3N65358: C206.2 MIC.2(-) R104.2
$3N65820: AMP.4(IN-) R105.2
$3N66044: C200.1 HEADSET.3
$3N66054: C199.1 HEADSET.4
$3N66059: C242.1 HEADSET.1 L18.1
$3N66555: AMP.3(IN+) R106.2
$3N66592: AMP.8(VO-) SPEAKER.1
$3N66597: AMP.5(VO+) SPEAKER.2
$3N73775: C238.1 RADIO.9(RCLK) X2.1
$3N73781: C239.2 RADIO.17(GPO3/[DCLK]) X2.2
$3N73999: C241.1 R121.1 RADIO.13(ROUT/[DOUT])
$3N74004: C240.1 R122.1 RADIO.14(LOUT/[DFS])
$3N78093: RADIO.19(GPO1) TP5.1
$3N79210: AUDIO.20(IN3_L) C244.2
$4N10766: D8.1(K) RIGHT1.1 RIGHT1.3
$4N10774: D7.1(K) TOP1.1 TOP1.3
$4N10782: D6.1(K) LEFT1.1 LEFT1.3
$4N10794: BOTTOM1.1 BOTTOM1.3 D5.1(K)
$4N10842: D15.1(K) VOL_DOWN.1
$4N10903: B1.1 B1.3 D9.1(K)
$4N10915: A1.1 A1.3 D10.1(K)
$4N17155: D14.1(K) VOL_UP.1
$4N18597: B3.1 B3.3 D12.1(K)
$4N18613: B2.1 B2.3 D11.1(K)
$4N38253: Q6.3(D) R84.2
$4N49584: LED10.4(DI) LED11.1(DO)
$4N49861: LED7.4(DI) LED8.1(DO)
$4N49881: LED7.1(DO) LED12.4(DI)
$4N49891: LED11.4(DI) LED12.1(DO)
$4N50022: R87.1 U33.4(B)
$4N50025: LED8.4(DI) R87.2
$4N50031: LED10.1(DO) R88.1
$4N56569: D4.2(A) Q9.3(D) RUMBLER.1
$4N56605: Q9.1(G) R54.1 R91.1
$4N56656: Q6.1(G) R55.1 R92.1
$4N78796: D17.1(K) HOME1.2
$4N81859: AVR.13(PB3/TOSC1) C232.2 X1.1
$4N81864: AVR.14(PB2/TOSC2) C233.2 X1.2
$6N10559: R57.1 USB.B5(CC2)
$6N10563: R58.1 USB.A5(CC1)
$7N680: R51.2 RP2350B.67(USB_DP)
$7N687: R50.2 RP2350B.66(USB_DM)
$7N1009: C154.1 R93.2 U39.3

Not connected (* = marked no-connect by the designer): 3V3 2(PG); AMP 2(NC); AUDIO 33(EP); DISPLAY 1(IM2) 2(IM1) 3(IM0) 4(GND) 8(LED-A) 25(GND) 26(RESX) 27(SPI_MISO) 28(SPI_MOSI) 34(VDD) 35(VDDI) 36(GND) 37(NC) 38(NC) 39(NC) 40(NC) 41 42; HEADSET 5 6; L15 7(IN7) 8(IN8) 9(OUT8) 10(OUT7); microSD 9(CD) 12(GND) 13(GND); PWR 4(STAT) 24(DSEL); R88 2; RADIO 1(NC) 15(DOUT) 16(DFS) 20(NC) 21(EP); RP2350B 35(RUN) 59(ADC_AVDD); U26 4(INT1) 10(OCSB) 11(OSDO); U41 2(NC) 5(INT); USB 13(EH) 14(EH) 15(EH) 16(EH) A8(SBU1) B8(SBU2); VDD 2(PG)
